# EAGLE design Line Follower (EAGLE 8.6.0)

## Sheet 1 of 4: Logic
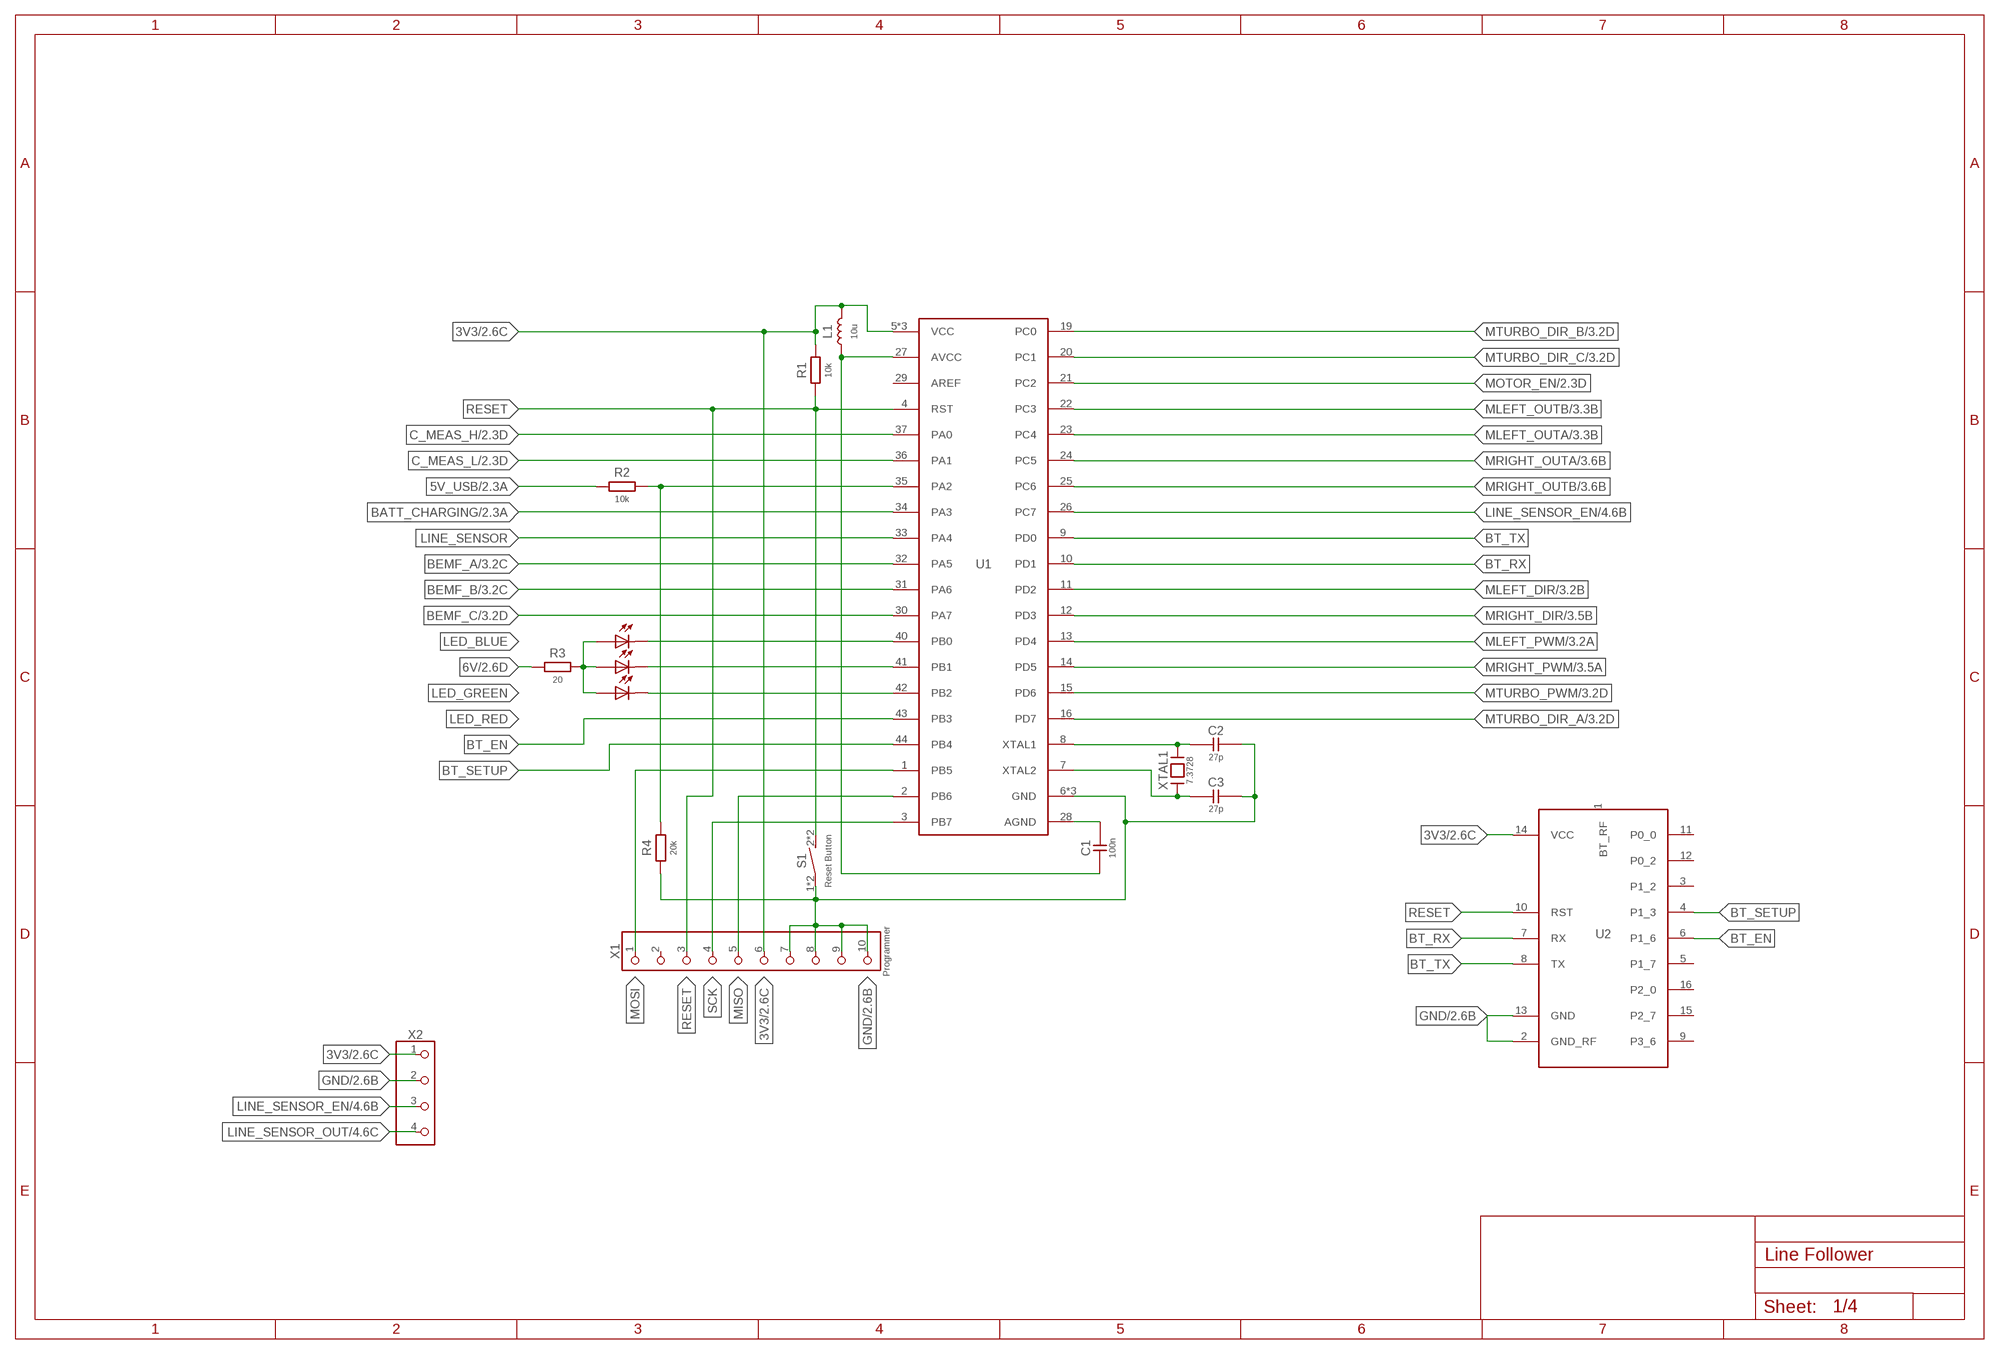
[diagram p0: schematic, sheet 1]

### Parts
C1  100n  CAPACITORSMD_1206  [SMD_1206]
C2  27p  CAPACITORSMD_1206  [SMD_1206]
C3  27p  CAPACITORSMD_1206  [SMD_1206]
D1  RGB_LEDOSTCXBSEC1E  [OSTCXBSEC1E]
L1  10u  INDUCTORSMD_1206  [SMD_1206]
R1  10k  RESISTORSMD_1206  [SMD_1206]
R2  10k  RESISTORSMD_1206  [SMD_1206]
R3  20  RESISTORSMD_1206  [SMD_1206]
R4  20k  RESISTORSMD_1206  [SMD_1206]
S1  Reset Button  SCHURTER_BUTTON  [SCHURTER_BUTTON]
U1  ATMEGA1284TQFP  [TQFP-44]
U2  RN4871  [RN4871]
X1  Programmer  CONNECTOR_10PINMALE_1WAY_2X5  [MALE_1WAY_2X5]
X2  CONNECTOR_4PINMALE_PIN_1X4  [MALE_PIN_1X4]
XTAL1  7.3728  OSCILLATORSMD_11MM  [SMD_OSCILLATOR]

### Nets
3V3: L1.2 R1.2 U1.5(VCC) U1.17(VCC) U1.38(VCC) U2.14(VCC) X1.6 X2.1 ; also sheet 2,3,4
5V_USB: R2.1 ; also sheet 2
6V: R3.2 ; also sheet 2,3
AVCC: C1.1 L1.1 U1.27(AVCC)
BATT_CHARGING: U1.34(PA3) ; also sheet 2
BEMF_A: U1.32(PA5) ; also sheet 3
BEMF_B: U1.31(PA6) ; also sheet 3
BEMF_C: U1.30(PA7) ; also sheet 3
BT_EN: U1.43(PB3) U2.6(P1_6)
BT_RX: U1.10(PD1) U2.7(RX)
BT_SETUP: U1.44(PB4) U2.4(P1_3)
BT_TX: U1.9(PD0) U2.8(TX)
C_MEAS_H: U1.37(PA0) ; also sheet 2
C_MEAS_L: U1.36(PA1) ; also sheet 2
GND [GND]: C2.1 C3.1 R4.1 S1.1(P) S1.3(P) U1.6(GND) U1.18(GND) U1.39(GND) U2.2(GND_RF) U2.13(GND) X1.7 X1.8 X1.9 X1.10 X2.2 ; also sheet 2,3,4
LED_BLUE: D1.3(BLUE:K) U1.40(PB0)
LED_GREEN: D1.1(GREEN:K) U1.41(PB1)
LED_RED: D1.2(RED:K) U1.42(PB2)
LINE_SENSOR: U1.33(PA4)
LINE_SENSOR_EN: U1.26(PC7) X2.3 ; also sheet 4
LINE_SENSOR_OUT: X2.4 ; also sheet 4
MISO: U1.2(PB6) X1.5
MLEFT_DIR: U1.11(PD2) ; also sheet 3
MLEFT_OUTA: U1.23(PC4) ; also sheet 3
MLEFT_OUTB: U1.22(PC3) ; also sheet 3
MLEFT_PWM: U1.13(PD4) ; also sheet 3
MOSI: U1.1(PB5) X1.1
MOTOR_EN: U1.21(PC2) ; also sheet 2,3
MRIGHT_DIR: U1.12(PD3) ; also sheet 3
MRIGHT_OUTA: U1.24(PC5) ; also sheet 3
MRIGHT_OUTB: U1.25(PC6) ; also sheet 3
MRIGHT_PWM: U1.14(PD5) ; also sheet 3
MTURBO_DIR_A: U1.16(PD7) ; also sheet 3
MTURBO_DIR_B: U1.19(PC0) ; also sheet 3
MTURBO_DIR_C: U1.20(PC1) ; also sheet 3
MTURBO_PWM: U1.15(PD6) ; also sheet 3
N$1: C3.2 U1.7(XTAL2) XTAL1.1
N$2: C2.2 U1.8(XTAL1) XTAL1.2
N$24: C1.2 U1.28(AGND)
N$37: D1.4(BLUE:A) D1.5(RED:A) D1.6(GREEN:A) D1.PAD(RED:A) R3.1
RESET [Signal]: R1.1 S1.2(S) S1.4(S) U1.4(RST) U2.10(RST) X1.3
SCK: U1.3(PB7) X1.4
USB_CONNECTED: R2.2 R4.2 U1.35(PA2)
Unconnected: U1.29(AREF) U2.1(BT_RF) U2.3(P1_2) U2.5(P1_7) U2.9(P3_6) U2.11(P0_0) U2.12(P0_2) U2.15(P2_7) U2.16(P2_0) X1.2

## Sheet 2 of 4: Power supply
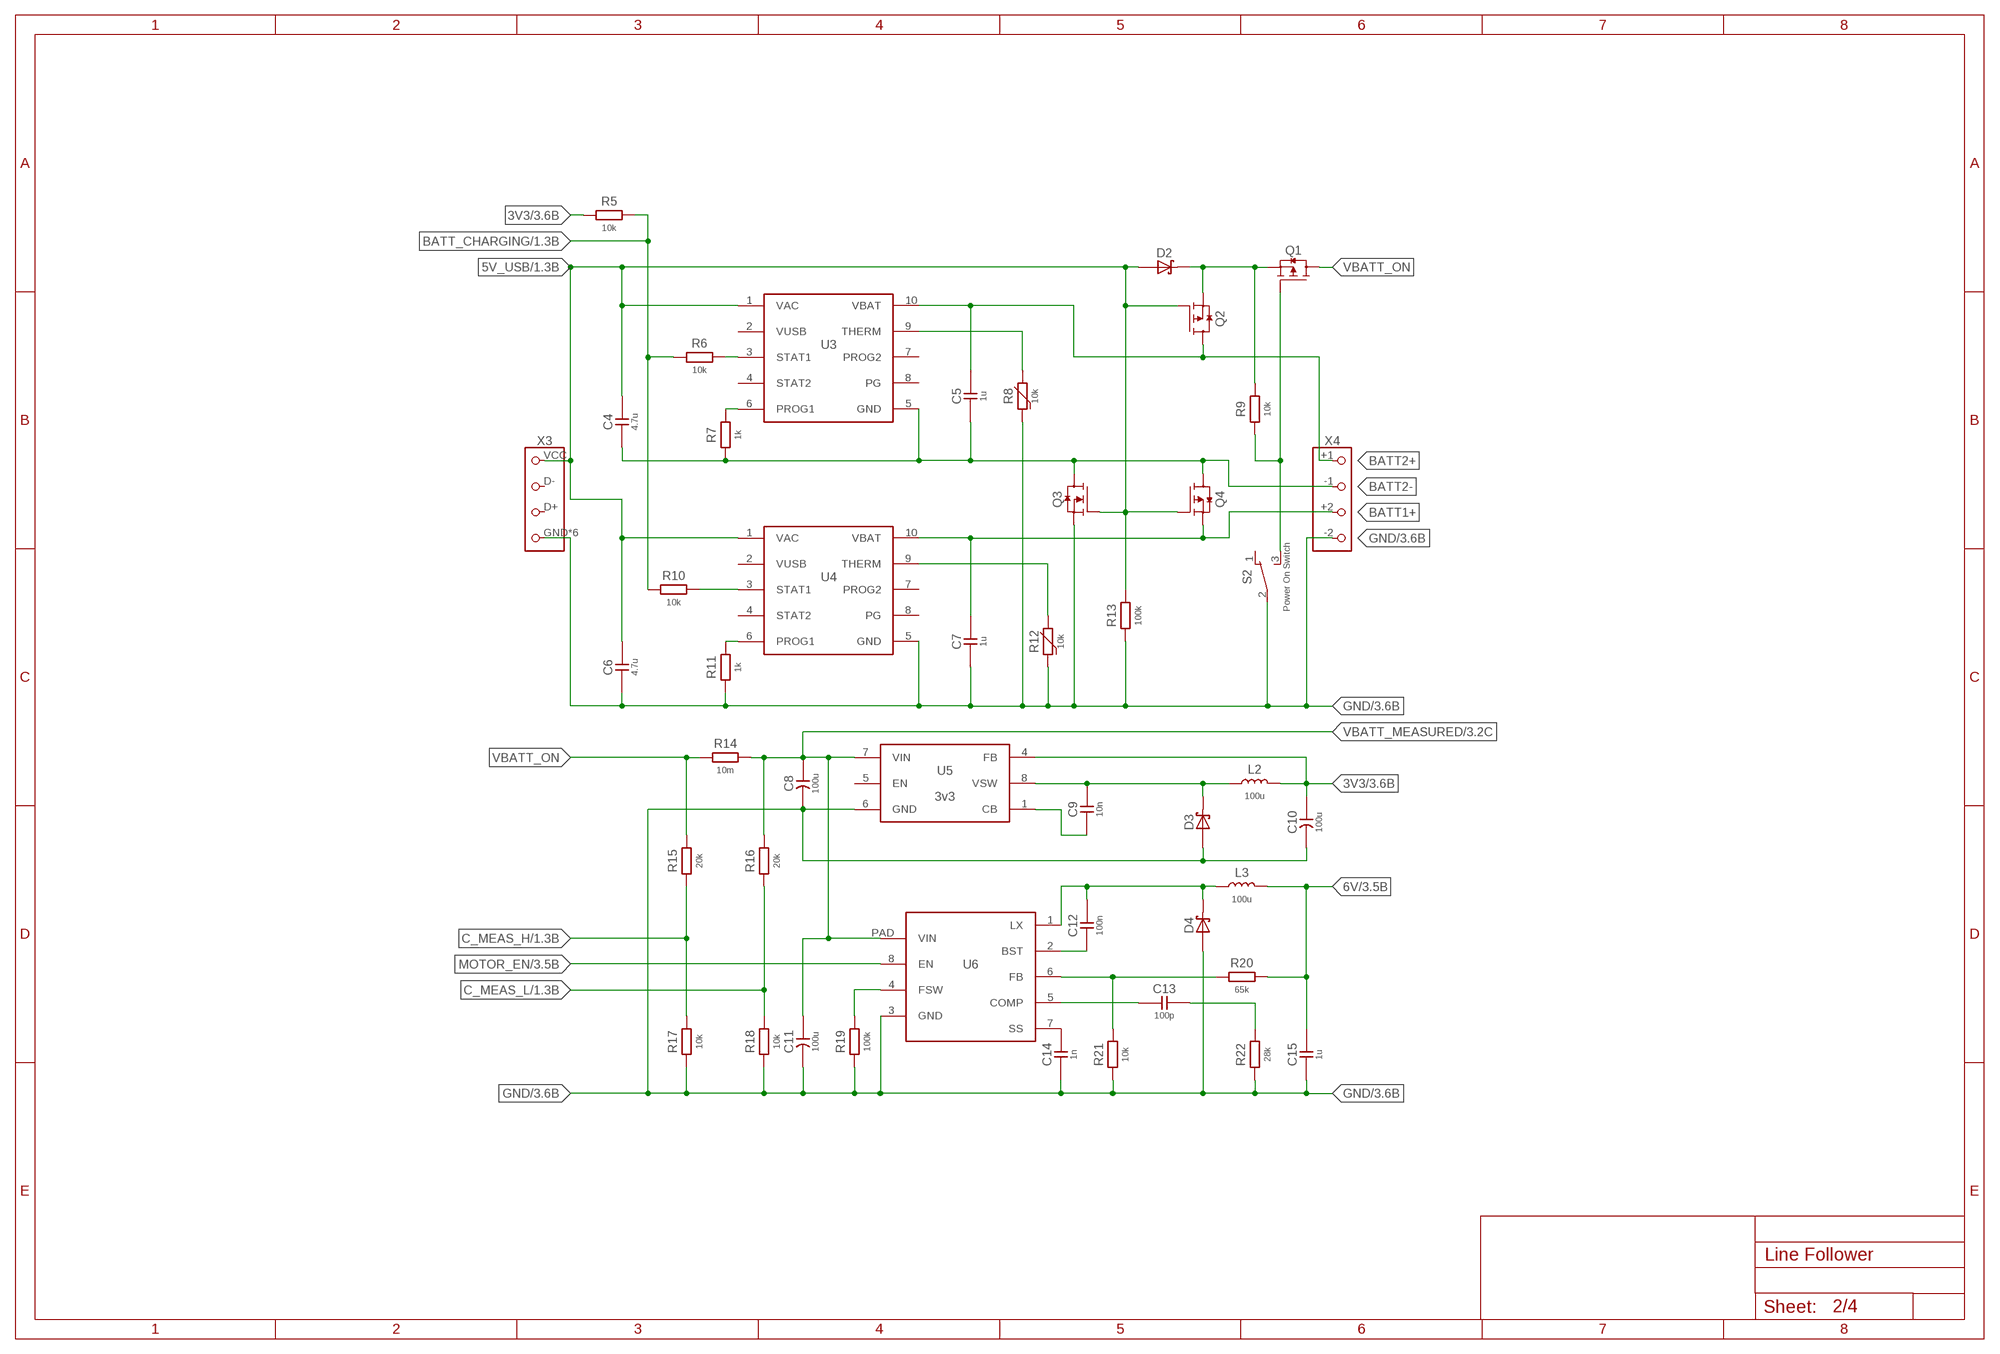
[diagram p1: schematic, sheet 2]

### Parts
C4  4.7u  CAPACITORSMD_1206  [SMD_1206]
C5  1u  CAPACITORSMD_1206  [SMD_1206]
C6  4.7u  CAPACITORSMD_1206  [SMD_1206]
C7  1u  CAPACITORSMD_1206  [SMD_1206]
C8  100u  ELECTROLYTIC_CAPACITORSMD_1210  [SMD_1210]
C9  10n  CAPACITORSMD_1206  [SMD_1206]
C10  100u  ELECTROLYTIC_CAPACITORSMD_1210  [SMD_1210]
C11  100u  ELECTROLYTIC_CAPACITORSMD_1210  [SMD_1210]
C12  100n  CAPACITORSMD_1206  [SMD_1206]
C13  100p  CAPACITORSMD_1206  [SMD_1206]
C14  1n  CAPACITORSMD_1206  [SMD_1206]
C15  1u  CAPACITORSMD_1206  [SMD_1206]
D2  BAS3010BSOD232  [SOD323]
D3  BAS3010BSOD232  [SOD323]
D4  BAS3010BSOD232  [SOD323]
L2  100u  INDUCTORSMD_1206  [SMD_1206]
L3  100u  INDUCTORSMD_1206  [SMD_1206]
Q1  AOD417  [TO-252]
Q2  AOD417  [TO-252]
Q3  AOD480  [TO-252]
Q4  AOD417  [TO-252]
R5  10k  RESISTORSMD_1206  [SMD_1206]
R6  10k  RESISTORSMD_1206  [SMD_1206]
R7  1k  RESISTORSMD_1206  [SMD_1206]
R8  10k  NTC_THERMISTOR  [SMD_0805]
R9  10k  RESISTORSMD_1206  [SMD_1206]
R10  10k  RESISTORSMD_1206  [SMD_1206]
R11  1k  RESISTORSMD_1206  [SMD_1206]
R12  10k  NTC_THERMISTOR  [SMD_0805]
R13  100k  RESISTORSMD_1206  [SMD_1206]
R14  10m  RESISTORSMD_1206  [SMD_1206]
R15  20k  RESISTORSMD_1206  [SMD_1206]
R16  20k  RESISTORSMD_1206  [SMD_1206]
R17  10k  RESISTORSMD_1206  [SMD_1206]
R18  10k  RESISTORSMD_1206  [SMD_1206]
R19  100k  RESISTORSMD_1206  [SMD_1206]
R20  65k  RESISTORSMD_1206  [SMD_1206]
R21  10k  RESISTORSMD_1206  [SMD_1206]
R22  28k  RESISTORSMD_1206  [SMD_1206]
S2  Power On Switch  NINIGI_5MS1  [NINIGI_5MS1]
U3  MCP73837MSOP_10  [MSOP_10]
U4  MCP73837MSOP_10  [MSOP_10]
U5  3v3  LM2674  [SO8]
U6  AOZ1284  [SO8_EP]
X3  USB_CONNECTORMICRO_USB  [MICRO_USB_FEMALE]
X4  CONNECTOR_4PINBATTERY_18650X2  [BATTERY_186501X2]

### Nets
3V3: C10.1(+) L2.2 R5.1 U5.4(FB) ; also sheet 1,3,4
5V_USB: C4.2 C6.2 D2.1(A) Q2.1(G) Q3.1(G) Q4.1(G) R13.2 U3.1(VAC) U4.1(VAC) X3.VCC ; also sheet 1
6V: C15.2 L3.2 R20.2 ; also sheet 1,3
BATT1+ [High Current]: C7.2 Q4.2(S) U4.10(VBAT) X4.+2
BATT2+ [High Current]: C5.2 Q2.3(D) U3.10(VBAT) X4.+1
BATT2- [High Current]: C4.1 C5.1 Q3.3(D) Q4.3(D) R7.1 U3.5(GND) X4.-1
BATT_CHARGING: R5.2 R6.1 R10.1 ; also sheet 1
BATTERY1_CHARGING1: R10.2 U4.3(STAT1)
BATTERY2_CHARGING1: R6.2 U3.3(STAT1)
C_MEAS_H: R15.1 R17.2 ; also sheet 1
C_MEAS_L: R16.1 R18.2 ; also sheet 1
GND [GND]: C6.1 C7.1 C8.2(-) C10.2(-) C11.2(-) C14.1 C15.1 D3.1(A) D4.1(A) Q3.2(S) R8.1 R11.1 R12.1 R13.1 R17.1 R18.1 R19.1 R21.1 R22.1 S2.2(MIDDLE) U4.5(GND) U5.6(GND) U6.3(GND) X3.GND X3.NC X3.NC@2 X3.NC@3 X3.NC@4 X3.NC@5 X4.-2 ; also sheet 1,3,4
MOTOR_EN: U6.8(EN) ; also sheet 1,3
N$3: C9.1 U5.1(CB)
N$41: R19.2 U6.4(FSW)
N$42: C14.2 U6.7(SS)
N$43: C13.1 U6.5(COMP)
N$44: C13.2 R22.2
N$45: C12.1 U6.2(BST)
N$46: C12.2 D4.2(K) L3.1 U6.1(LX)
N$48: R20.1 R21.2 U6.6(FB)
THERM2 [Signal]: R12.2 U4.9(THERM)
THERM3 [Signal]: R8.2 U3.9(THERM)
V_LIMIT2 [Signal]: R11.2 U4.6(PROG1)
V_LIMIT3 [Signal]: R7.2 U3.6(PROG1)
VBATT1: D2.2(K) Q1.2(S) Q2.2(S) R9.2
VBATT_MEASURED [High Current]: C8.1(+) C11.1(+) R14.2 R16.2 U5.7(VIN) U6.PAD(VIN) ; also sheet 3
VBATT_ON [High Current]: Q1.3(D) R14.1 R15.2
VG1: Q1.1(G) R9.1 S2.3(SIDE2)
VSW: C9.2 D3.2(K) L2.1 U5.8(VSW)
Unconnected: S2.1(SIDE1) U3.4(STAT2) U3.7(PROG2) U3.8(PG) U4.4(STAT2) U4.7(PROG2) U4.8(PG) U5.5(EN) X3.D+ X3.D-

## Sheet 3 of 4: Motors
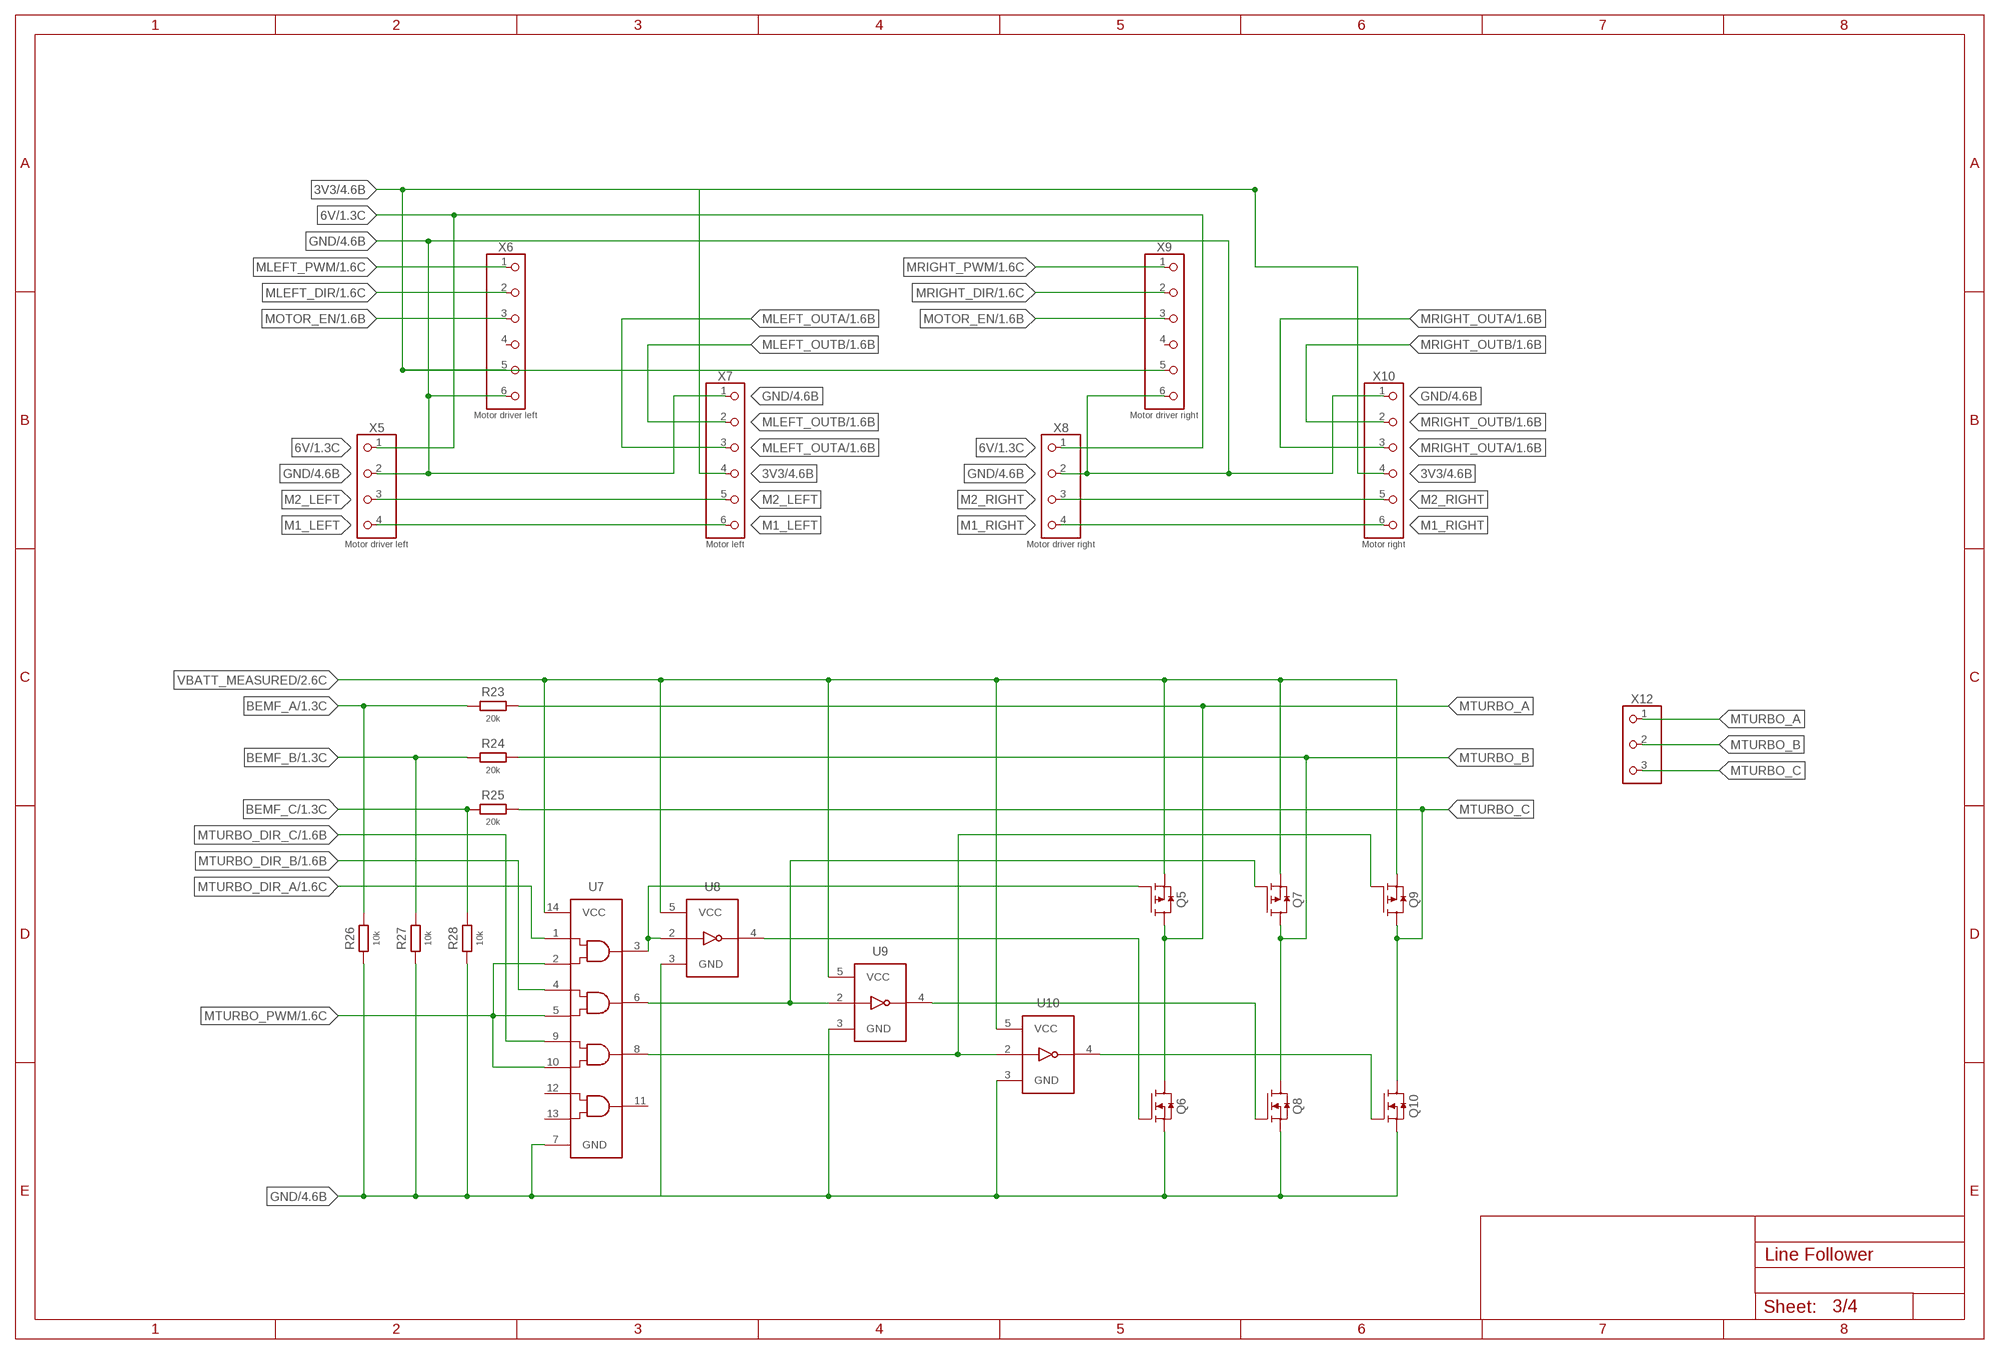
[diagram p2: schematic, sheet 3]

### Parts
Q5  AOD417  [TO-252]
Q6  AOD480  [TO-252]
Q7  AOD417  [TO-252]
Q8  AOD480  [TO-252]
Q9  AOD417  [TO-252]
Q10  AOD480  [TO-252]
R23  20k  RESISTORSMD_1206  [SMD_1206]
R24  20k  RESISTORSMD_1206  [SMD_1206]
R25  20k  RESISTORSMD_1206  [SMD_1206]
R26  10k  RESISTORSMD_1206  [SMD_1206]
R27  10k  RESISTORSMD_1206  [SMD_1206]
R28  10k  RESISTORSMD_1206  [SMD_1206]
U7  74AHC08D  [SO14]
U8  74LVC1G14SOT25  [SOT25]
U9  74LVC1G14SOT25  [SOT25]
U10  74LVC1G14SOT25  [SOT25]
X5  Motor driver left  CONNECTOR_4PINMALE_PIN_1X4  [MALE_PIN_1X4]
X6  Motor driver left  CONNECTOR_6PINMALE_PIN_1X6  [MALE_PIN_1X6]
X7  Motor left  CONNECTOR_6PINMALE_PIN_2X3  [MALE_PIN_2X3]
X8  Motor driver right  CONNECTOR_4PINMALE_PIN_1X4  [MALE_PIN_1X4]
X9  Motor driver right  CONNECTOR_6PINMALE_PIN_1X6  [MALE_PIN_1X6]
X10  Motor right  CONNECTOR_6PINMALE_PIN_2X3  [MALE_PIN_2X3]
X12  CONNECTOR_3PIN  [SCREW_1X3]

### Nets
3V3: X6.5 X7.4 X9.5 X10.4 ; also sheet 1,2,4
6V: X5.1 X8.1 ; also sheet 1,2
BEMF_A: R23.1 R26.2 ; also sheet 1
BEMF_B: R24.1 R27.2 ; also sheet 1
BEMF_C: R25.1 R28.2 ; also sheet 1
GND [GND]: Q6.2(S) Q8.2(S) Q10.2(S) R26.1 R27.1 R28.1 U7.7(GND) U8.3(GND) U9.3(GND) U10.3(GND) X5.2 X6.6 X7.1 X8.2 X9.6 X10.1 ; also sheet 1,2,4
M1_LEFT: X5.4 X7.6
M1_RIGHT: X8.4 X10.6
M2_LEFT: X5.3 X7.5
M2_RIGHT: X8.3 X10.5
MLEFT_DIR: X6.2 ; also sheet 1
MLEFT_OUTA: X7.3 ; also sheet 1
MLEFT_OUTB: X7.2 ; also sheet 1
MLEFT_PWM: X6.1 ; also sheet 1
MOTOR_EN: X6.3 X9.3 ; also sheet 1,2
MRIGHT_DIR: X9.2 ; also sheet 1
MRIGHT_OUTA: X10.3 ; also sheet 1
MRIGHT_OUTB: X10.2 ; also sheet 1
MRIGHT_PWM: X9.1 ; also sheet 1
MTURBO_A [High Current]: Q5.3(D) Q6.3(D) R23.2 X12.1
MTURBO_B [High Current]: Q7.3(D) Q8.3(D) R24.2 X12.2
MTURBO_C [High Current]: Q9.3(D) Q10.3(D) R25.2 X12.3
MTURBO_DIR_A: U7.1(A1) ; also sheet 1
MTURBO_DIR_B: U7.4(A2) ; also sheet 1
MTURBO_DIR_C: U7.9(A3) ; also sheet 1
MTURBO_PWM: U7.2(B1) U7.5(B2) U7.10(B3) ; also sheet 1
N$5: Q5.1(G) U7.3(Y1) U8.2(A)
N$6: Q6.1(G) U8.4(Y)
N$19: Q7.1(G) U7.6(Y2) U9.2(A)
N$38: Q8.1(G) U9.4(Y)
N$39: Q10.1(G) U10.4(Y)
N$40: Q9.1(G) U7.8(Y3) U10.2(A)
VBATT_MEASURED [High Current]: Q5.2(S) Q7.2(S) Q9.2(S) U7.14(VCC) U8.5(VCC) U9.5(VCC) U10.5(VCC) ; also sheet 2
Unconnected: U7.11(Y4) U7.12(A4) U7.13(B4) X6.4 X9.4

## Sheet 4 of 4: Sensors
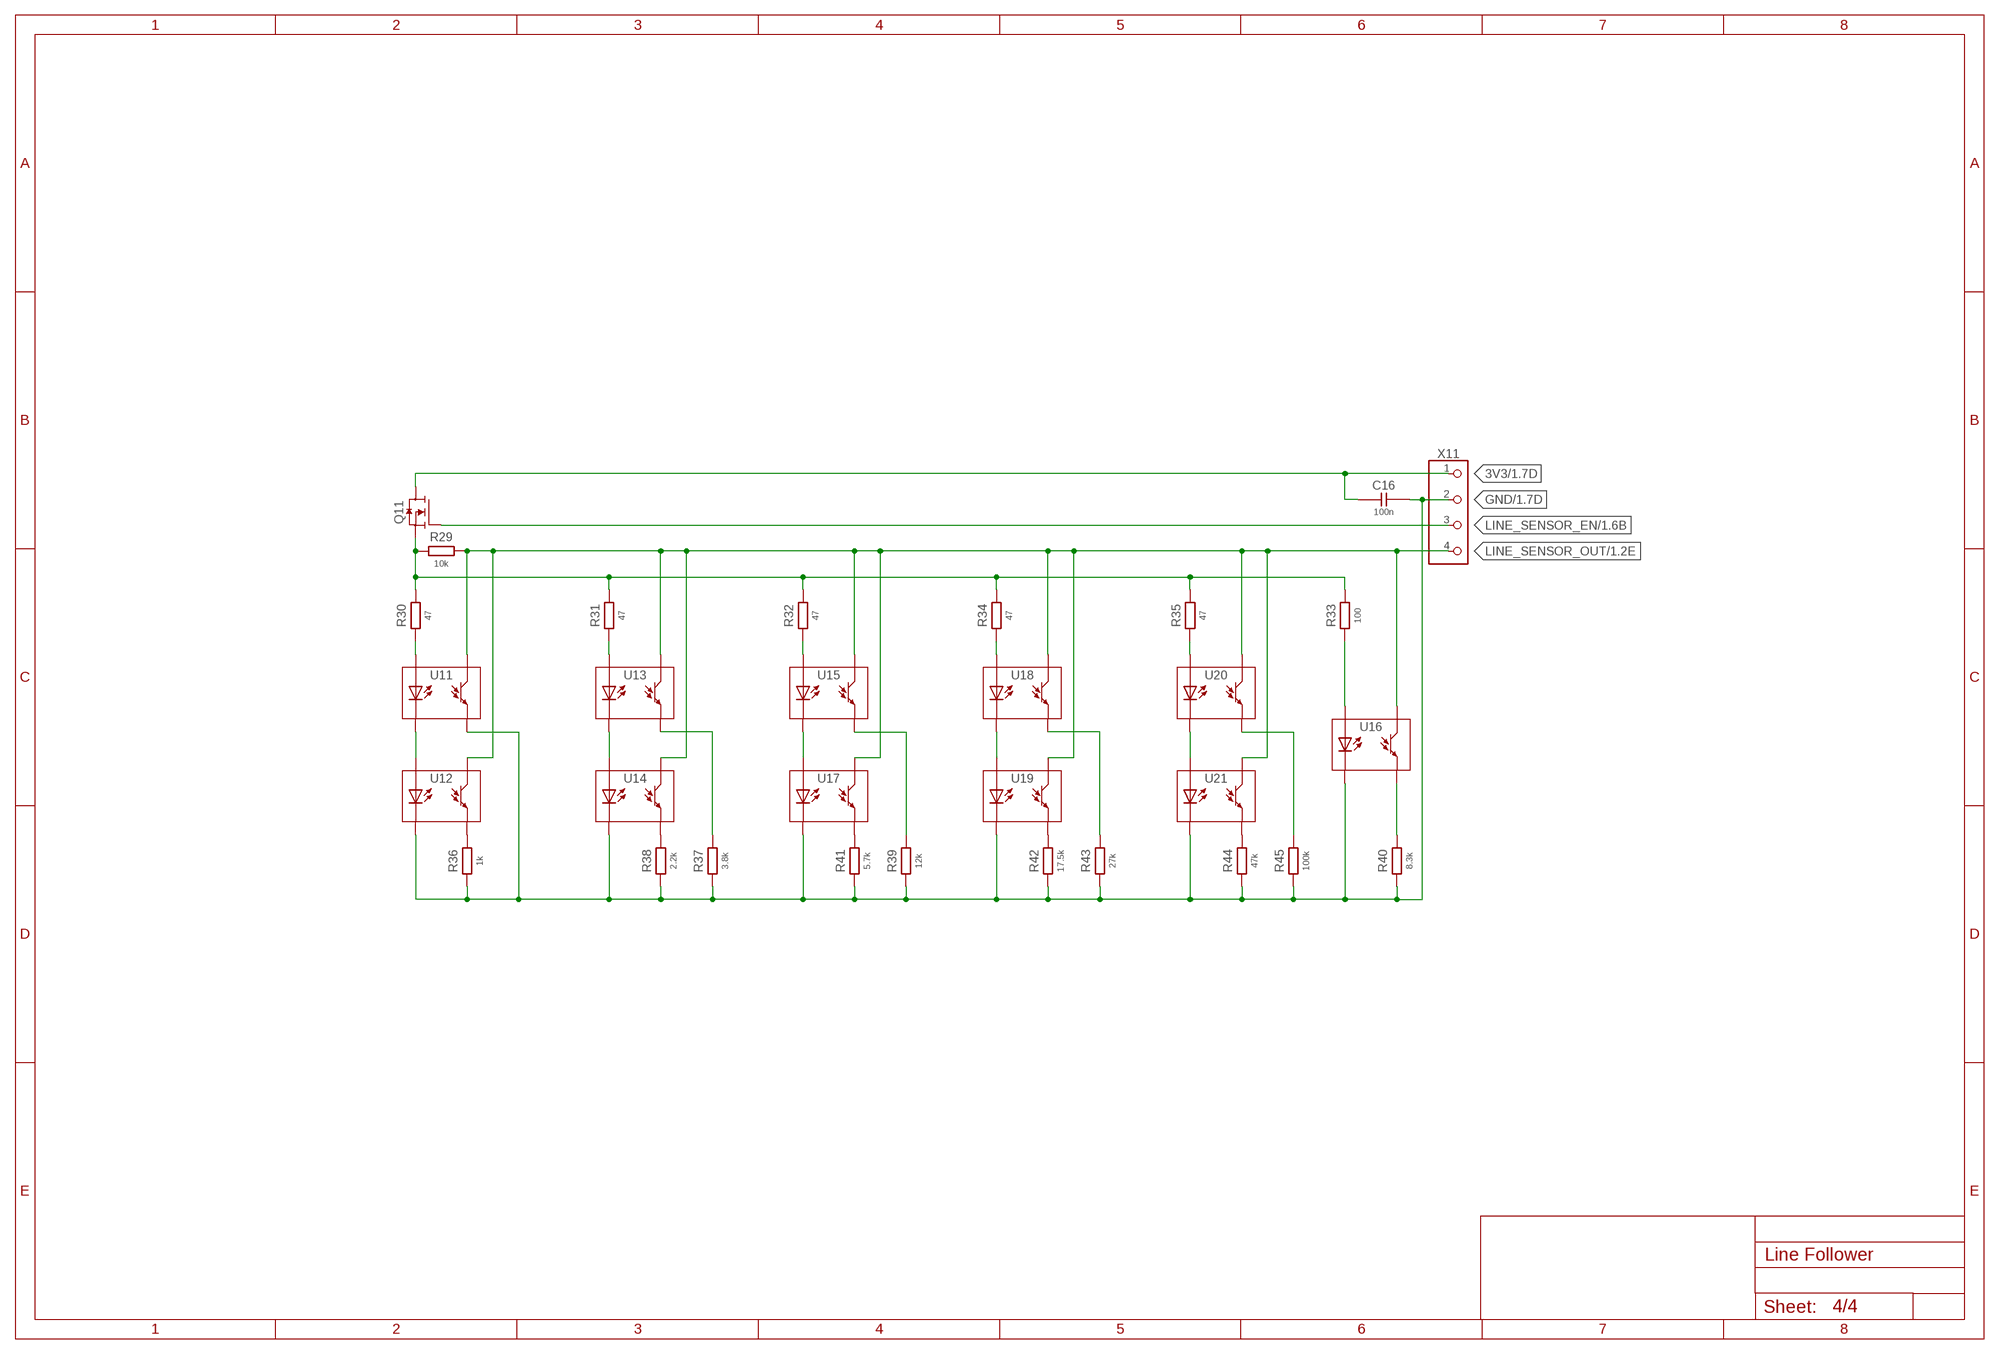
[diagram p3: schematic, sheet 4]

### Parts
C16  100n  CAPACITORSMD_1206  [SMD_1206]
Q11  AO3414SOT23  [SOT23]
R29  10k  RESISTORSMD_1206  [SMD_1206]
R30  47  RESISTORSMD_1206  [SMD_1206]
R31  47  RESISTORSMD_1206  [SMD_1206]
R32  47  RESISTORSMD_1206  [SMD_1206]
R33  100  RESISTORSMD_1206  [SMD_1206]
R34  47  RESISTORSMD_1206  [SMD_1206]
R35  47  RESISTORSMD_1206  [SMD_1206]
R36  1k  RESISTORSMD_1206  [SMD_1206]
R37  3.8k  RESISTORSMD_1206  [SMD_1206]
R38  2.2k  RESISTORSMD_1206  [SMD_1206]
R39  12k  RESISTORSMD_1206  [SMD_1206]
R40  8.3k  RESISTORSMD_1206  [SMD_1206]
R41  5.7k  RESISTORSMD_1206  [SMD_1206]
R42  17.5k  RESISTORSMD_1206  [SMD_1206]
R43  27k  RESISTORSMD_1206  [SMD_1206]
R44  47k  RESISTORSMD_1206  [SMD_1206]
R45  100k  RESISTORSMD_1206  [SMD_1206]
U11  EE-SY171  [EE-SY171]
U12  EE-SY171  [EE-SY171]
U13  EE-SY171  [EE-SY171]
U14  EE-SY171  [EE-SY171]
U15  EE-SY171  [EE-SY171]
U16  EE-SY171  [EE-SY171]
U17  EE-SY171  [EE-SY171]
U18  EE-SY171  [EE-SY171]
U19  EE-SY171  [EE-SY171]
U20  EE-SY171  [EE-SY171]
U21  EE-SY171  [EE-SY171]
X11  CONNECTOR_4PINMALE_PIN_1X4  [MALE_PIN_1X4]

### Nets
3V3: C16.1 Q11.3(D) X11.1 ; also sheet 1,2,3
3V3_SENSOR_LEDS: Q11.2(S) R29.1 R30.2 R31.2 R32.2 R33.2 R34.2 R35.2
GND [GND]: C16.2 R36.1 R37.1 R38.1 R39.1 R40.1 R41.1 R42.1 R43.1 R44.1 R45.1 U11.E U12.K U14.K U16.K U17.K U19.K U21.K X11.2 ; also sheet 1,2,3
LINE_SENSOR_EN: Q11.1(G) X11.3 ; also sheet 1
LINE_SENSOR_OUT: R29.2 U11.C U12.C U13.C U14.C U15.C U16.C U17.C U18.C U19.C U20.C U21.C X11.4 ; also sheet 1
N$4: R36.2 U12.E
N$7: R37.2 U13.E
N$8: R30.1 U11.A
N$9: U11.K U12.A
N$10: R32.1 U15.A
N$11: R31.1 U13.A
N$12: U13.K U14.A
N$13: U15.K U17.A
N$14: R34.1 U18.A
N$15: U18.K U19.A
N$16: R35.1 U20.A
N$17: U20.K U21.A
N$18: R33.1 U16.A
N$21: R38.2 U14.E
N$23: R41.2 U17.E
N$25: R39.2 U15.E
N$26: R43.2 U18.E
N$27: R42.2 U19.E
N$28: R45.2 U20.E
N$29: R44.2 U21.E
N$30: R40.2 U16.E

## Power pins joined to a net without a drawn wire
VUSB: U3.2(VUSB) U4.2(VUSB)

## Library data of the parts
C1-C7 C9 C12-C16 = Passives:CAPACITOR: Capacitor
C8 C10 C11 = Passives:ELECTROLYTIC_CAPACITOR: Polarized Capacitor
D1 = Diodes:RGB_LED: RGB Light Emitting Diode Component Datasheet Size Max Current Red Green Blue Forward Voltage Light Intensity Forward Voltage Light Intensity Forward Voltage Light Intensity OSTCXBSEC1E link <https://drive.google.com/open?id=0Bx3EyoegSWevejRzQ2RTeXJZWlE> 5 x 5 mm 0.2 A 3 V 20 cd 4 V 30 cd 4 V 10 cd
D2-D4 = Diodes:BAS3010B: 1A Schottky Diode Datasheet <https://drive.google.com/open?id=1SUklUejxSsK_loDkWrmXe8l06rycU1cd>
L1-L3 = Passives:INDUCTOR: Inductor
Q1 Q2 Q4 Q5 Q7 Q9 = Transistors:AOD417: P-Channel Power MOSFET Datasheet <https://drive.google.com/open?id=1Aunkt1MHwGkiisX0zOAecL08vsd4hyX1>
Q3 Q6 Q8 Q10 = Transistors:AOD480: N-Channel Power MOSFET Datasheet <https://drive.google.com/open?id=1A--VhvA1nJOWM3Svf2NN694U875h77Qz>
Q11 = Transistors:AO3414: N-Channel MOSFET Datasheet <https://drive.google.com/open?id=1qTh0uGaWsRbTcbcgMJPDG488iiwtG9qB>
R1-R7 R9-R11 R13-R45 = Passives:RESISTOR: Resistor
R8 R12 = Sensors:NTC_THERMISTOR: NTC thermistor Datasheet <https://drive.google.com/open?id=1b__oivFvJCLTu-I3nkRL9Yym-Pu1nq4O>
S1 = Switches:SCHURTER_BUTTON: Schurter 4 pin push button Datasheet <https://drive.google.com/open?id=0Bx3EyoegSWevNWNmZm9YRVBlUGM>
S2 = Switches:NINIGI_5MS1: Ninigi Sliding ON-ON Switch Datasheet <https://drive.google.com/open?id=0Bx3EyoegSWevV2ZieUhfOUJ4c3M>
U1 = Microcontrollers:ATMEGA1284: ATmega1284 microcontroller Datasheet <https://drive.google.com/open?id=0Bx3EyoegSWevTDFya0JFOFlISGs> Component Supply Voltage Flash RAM EEPROM GPIO SPI I²C USART ADC Analog Comparator Timer PWM channels ATmega164A 1.8 - 5.5 V 16 KB 1 KB 512 B 32 1 1 2 8 Yes 2x 8bit 1x16bit 6 ATmega1284 1.8 - 5.5 V 128 KB 16 KB 4 KB 32 1 1 2 8 Yes 2x 8bit 2x16bit 8
U2 = Connectivity:RN4871: Bluetooth Low Energy Module Datasheet <https://drive.google.com/open?id=1NkqynHbIP-o5lnyX2JICYtW1r08LJTsi>
U3 U4 = Power Supplies:MCP73837: Battery Charger IC Datasheet <https://drive.google.com/open?id=1-k8jIzv3KBvhRDoBXnw6zvFG6jC2mRKT>
U5 = Power Supplies:LM2674: 0.5A Buck Voltage Regulator Datasheet <https://drive.google.com/open?id=1WJqYYVweJX4pnpGntj-szZUzQ_4m9e_Y>
U6 = Power Supplies:AOZ1284: 4A Switching Voltage Regulator Datasheet <https://drive.google.com/open?id=1SnWALYsNMSSKAO4NdofQXGKhfeYloVpu>
U7 = Logic Gates:74AHC08D: 4x AND Gate Datasheet <https://drive.google.com/open?id=1PSXJBb9GabwWpHZvc_EieywMAM0f-NCc>
U8-U10 = Logic Gates:74LVC1G14: NOT Gate Datasheet <https://drive.google.com/open?id=1jwQqcpQM22X5ci8ic_J9g7CQ6ZkM5pUF>
U11-U21 = Sensors:EE-SY171: EE-SY171 Photosensor Datasheet <https://drive.google.com/file/d/0Bx3EyoegSWevTVJucUhmTTlDck0>
X1 = Connectors:CONNECTOR_10PIN: 10 Pin Connector
X2 X4 X5 X8 X11 = Connectors:CONNECTOR_4PIN: 4 Pin Connector
X3 = Connectors:USB_CONNECTOR: USB Connector
X6 X7 X9 X10 = Connectors:CONNECTOR_6PIN: 6 Pin Connector
X12 = Connectors:CONNECTOR_3PIN: 3 Pin Connector
XTAL1 = Passives:OSCILLATOR: Crystal oscillator

## Net classes
0 VCC: width 1 mm, drill 0.4 mm, clearance 0.2 mm
1 GND: width 1 mm, drill 0.4 mm, clearance 0.2 mm
2 Signal: width 0.3 mm, drill 0.4 mm, clearance 0.2 mm
3 High Current: width 2 mm, drill 0.4 mm, clearance 0.2 mm

## Board
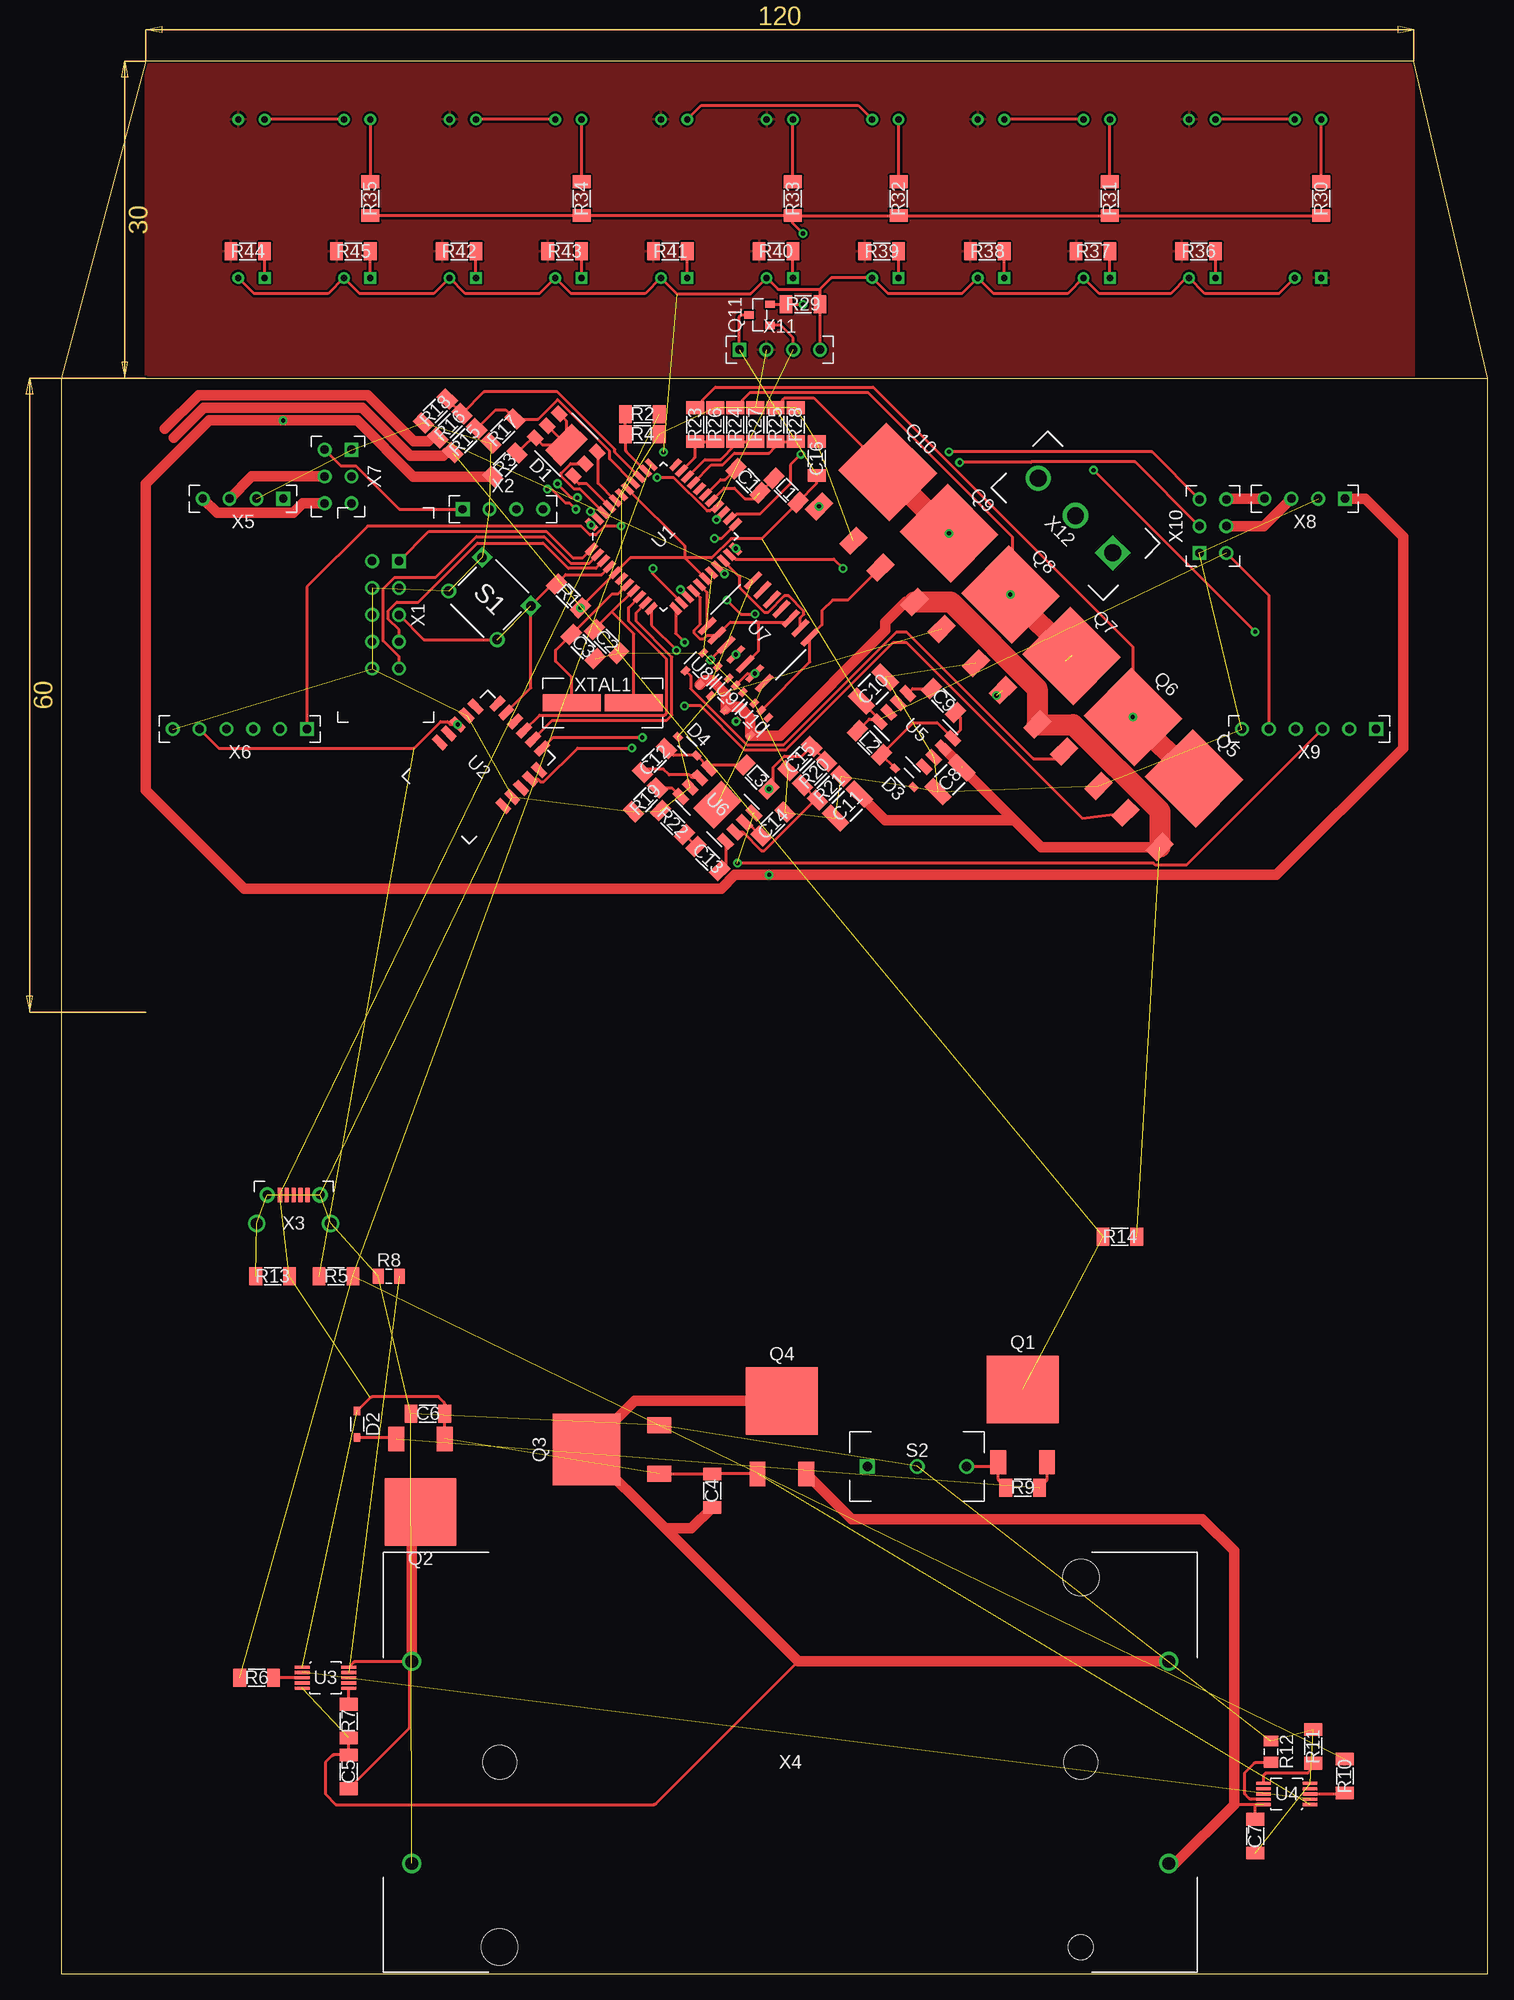
[diagram p4: board, top side]
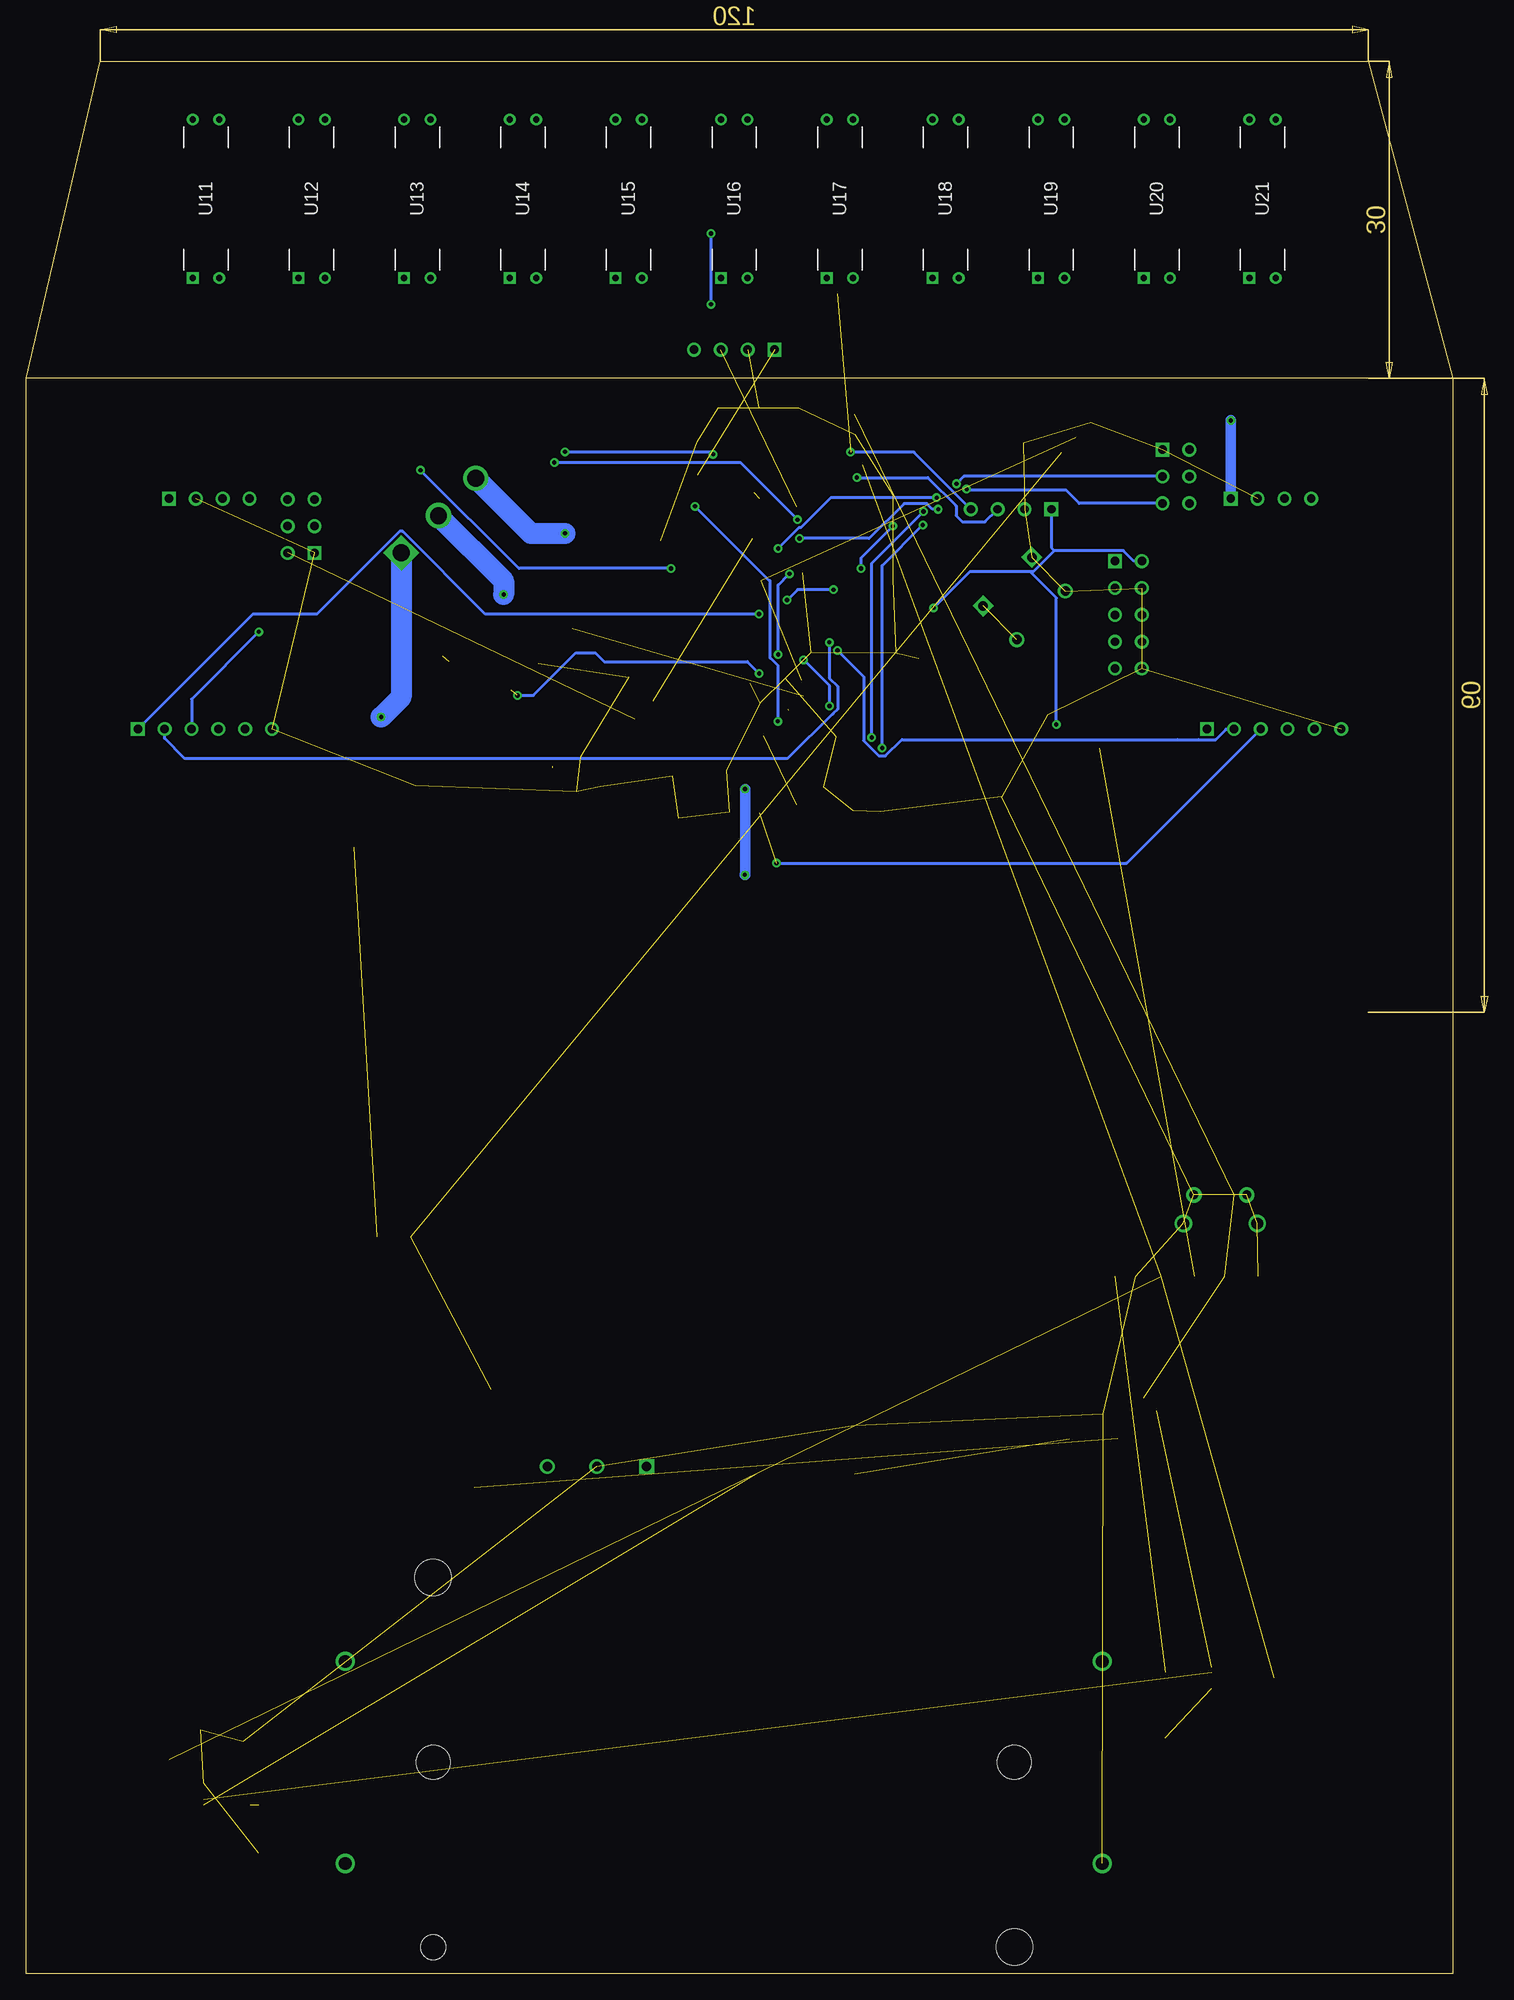
[diagram p5: board, bottom side, seen from below]

Size 135 x 181 mm. Coordinates in mm from the lower left corner, seen from the top.
Outline: 135,151 135,0 0,0 0,151
Outline: 0,151 8,181 128,181 135,151
Outline: 0,151 135,151
Copper layers (1*16): Top 0.035mm / dielectric 1.5mm / Bottom 0.035mm
Design rules "Design Rules": minimum track width 0.2mm, minimum drill 0.4mm, track to track 0.2mm, track to pad 0.2mm, pad to pad 0.2mm, via to via 0.2mm, smd to smd 0.2mm, copper to edge 0.2mm, drill to drill 0.5mm, minimum pad ring 10mil, minimum via ring 8mil, stop-mask expansion 4mil, vias tented up to drill 0mil, thermal gap 10mil

### Footprints (pad centres in the part's own frame; a part is rotated, then mirrored left to right if it is on the bottom)
SMD_1206 = smd 1.2 x 1.7: 1 -1.6,0; 2 1.6,0
SMD_1210 = smd 1.2 x 2.5: 1 -1.6,0; 2 1.6,0
OSTCXBSEC1E = smd 1.3 x 1: 1 -2.55,1.6; 2 -2.55,0; 3 -2.55,-1.6; 4 2.55,-1.6; 5 2.55,0; 6 2.55,1.6 | smd 2.1 x 3.6: PAD 0,0
SOD323 = smd 0.8 x 0.6: 1 -1.25,0; 2 1.25,0
TO-252 = smd 1.5 x 2.3: 1 -2.3,-4.6; 2 2.3,-4.6 | smd 6.8 x 6.4: 3 0,2.3
SOT23 = smd 0.7 x 0.9: 1 -1,-1; 2 1,-1; 3 0,1
SMD_0805 = smd 1 x 1.4: 1 -1,0; 2 1,0
SCHURTER_BUTTON = drill 0.9 square: 1 -3.25,2.25; 2 3.25,2.25 | drill 0.9: 3 -3.25,-2.25; 4 3.25,-2.25
NINIGI_5MS1 = drill 0.9 square: 1 -4.7,0 | drill 0.9: 2 0,0; 3 4.7,0
TQFP-44 = smd 1.27 x 0.508: 1 -5.627,4; 2 -5.627,3.2; 3 -5.627,2.4; 4 -5.627,1.6; 5 -5.627,0.8; 6 -5.627,0; 7 -5.627,-0.8; 8 -5.627,-1.6; 9 -5.627,-2.4; 10 -5.627,-3.2; 11 -5.627,-4; 23 5.627,-4; 24 5.627,-3.2; 25 5.627,-2.4; 26 5.627,-1.6; 27 5.627,-0.8; 28 5.627,0; 29 5.627,0.8; 30 5.627,1.6; 31 5.627,2.4; 32 5.627,3.2; 33 5.627,4 | smd 0.508 x 1.27: 12 -4,-5.627; 13 -3.2,-5.627; 14 -2.4,-5.627; 15 -1.6,-5.627; 16 -0.8,-5.627; 17 0,-5.627; 18 0.8,-5.627; 19 1.6,-5.627; 20 2.4,-5.627; 21 3.2,-5.627; 22 4,-5.627; 34 4,5.627; 35 3.2,5.627; 36 2.4,5.627; 37 1.6,5.627; 38 0.8,5.627; 39 0,5.627; 40 -0.8,5.627; 41 -1.6,5.627; 42 -2.4,5.627; 43 -3.2,5.627; 44 -4,5.627
RN4871 = smd 1.5 x 0.7: 1 -4.25,0.95; 2 -4.25,-0.25; 3 -4.25,-1.45; 4 -4.25,-2.65; 5 -4.25,-3.85; 12 4.25,-3.85; 13 4.25,-2.65; 14 4.25,-1.45; 15 4.25,-0.25; 16 4.25,0.95 | smd 0.7 x 1.5: 6 -3,-5.5; 7 -1.8,-5.5; 8 -0.6,-5.5; 9 0.6,-5.5; 10 1.8,-5.5; 11 3,-5.5
MSOP_10 = smd 1.4 x 0.3: 1 -2.2,1; 2 -2.2,0.5; 3 -2.2,0; 4 -2.2,-0.5; 5 -2.2,-1; 6 2.2,-1; 7 2.2,-0.5; 8 2.2,0; 9 2.2,0.5; 10 2.2,1
SO8 = smd 1.5 x 0.8: 1 -3,1.905; 2 -3,0.635; 3 -3,-0.635; 4 -3,-1.905; 5 3,-1.905; 6 3,-0.635; 7 3,0.635; 8 3,1.905
SO8_EP = smd 1.5 x 0.8: 1 -3,1.905; 2 -3,0.635; 3 -3,-0.635; 4 -3,-1.905; 5 3,-1.905; 6 3,-0.635; 7 3,0.635; 8 3,1.905 | smd 2.7 x 3.7: PAD 0,0
SO14 = smd 0.5 x 2: 1 -3.81,-3.05; 2 -2.54,-3.05; 3 -1.27,-3.05; 4 0,-3.05; 5 1.27,-3.05; 6 2.54,-3.05; 7 3.81,-3.05; 8 3.81,3.05; 9 2.54,3.05; 10 1.27,3.052; 11 0,3.05; 12 -1.27,3.05; 13 -2.54,3.05; 14 -3.81,3.05
SOT25 = smd 0.55 x 0.8: 1 0.95,1.2; 2 0,1.2; 3 -0.95,1.2; 4 -0.95,-1.2; 5 0.95,-1.2
EE-SY171 = drill 0.6: A 7.5,1.25; C -7.5,-1.25; K 7.5,-1.25 | drill 0.6 square: E -7.5,1.25
MALE_1WAY_2X5 = drill 0.8 square: 1 -5.08,1.27 | drill 0.8: 2 -2.54,1.27; 3 0,1.27; 4 2.54,1.27; 5 5.08,1.27; 6 -5.08,-1.27; 7 -2.54,-1.27; 8 0,-1.27; 9 2.54,-1.27; 10 5.08,-1.27
MALE_PIN_1X4 = drill 0.8 square: 1 -3.81,0 | drill 0.8: 2 -1.27,0; 3 1.27,0; 4 3.81,0
MICRO_USB_FEMALE = smd 0.4 x 1.35: D+ 0,2.7; D- -0.65,2.7; GND 1.3,2.7; NC 0.65,2.7; VCC -1.3,2.7 | drill 0.85 pad 1.45: NC@2 -2.5,2.7; NC@3 2.5,2.7 | drill 1.1: NC@4 -3.5,0; NC@5 3.5,0
BATTERY_186501X2 = drill 1.2: +1 -35.82,9.55; +2 35.82,-9.58; -1 35.82,9.55; -2 -35.82,-9.58 | hole 3.18: -27.5,0; 27.5,0 | hole 3.45: -27.5,-17.5; 27.5,17.5 | hole 2.38: 27.5,-17.5
MALE_PIN_1X6 = drill 0.8 square: 1 -6.35,0 | drill 0.8: 2 -3.81,0; 3 -1.27,0; 4 1.27,0; 5 3.81,0; 6 6.35,0
MALE_PIN_2X3 = drill 0.8 square: 1 -2.54,1.27 | drill 0.8: 2 0,1.27; 3 2.54,1.27; 4 -2.54,-1.27; 5 0,-1.27; 6 2.54,-1.27
SCREW_1X3 = drill 1.6 square: 1 -5,0 | drill 1.6: 2 0,0; 3 5,0
SMD_OSCILLATOR = smd 5.5 x 1.6: 1 -2.95,0; 2 2.95,0

### Placement (x,y rotation side)
C1  65,141.3 135 top
C2  51.6,126.1 135 top
C3  49.4,125.6 135 top
C4  61.6,45.7 90 top
C5  27.2,19.1 270 top
C6  34.7,53 0 top
C7  113,13 90 top
C8  84.1,113 225 top
C9  83.5,120.5 315 top
C10  76.86,121.57 45 top
C11  74.4,110.5 225 top
C12  56.14,114.82 45 top
C13  61.2,105.54 135 top
C14  67.36,108.8 225 top
C15  69.9,115 45 top
C16  71.5,143.4 90 top
D1  47.8,144.7 135 top
D2  28,52 270 top
D3  79.8,113.2 135 top
D4  59.24,116.18 315 top
L1  68.6,140.4 315 top
L2  76.5,116.5 135 top
L3  65.85,113.25 315 top
Q1  91,53 0 top
Q2  34,46 180 top
Q3  52,49.6 90 top
Q4  68.2,51.9 0 top
Q5  105.6,111.5 315 top
Q6  99.8,117.3 315 top
Q7  94,123.1 315 top
Q8  88.2,128.9 315 top
Q9  82.4,134.7 315 top
Q10  76.6,140.5 315 top
Q11  66.1,157 90 top
R1  48,130.4 315 top
R2  55,147.6 180 top
R3  42,142.8 225 top
R4  55,145.7 180 top
R5  26,66 0 top
R6  18.5,28 0 top
R7  27.2,23.9 90 top
R8  31,66 0 top
R9  91,46 0 top
R10  121.5,18.7 270 top
R11  118.5,21.5 270 top
R12  114.5,21 270 top
R13  20,66 0 top
R14  100.2,69.74 0 top
R15  38.2,145.1 225 top
R16  36.8,146.5 225 top
R17  41.8,146 45 top
R18  35.4,147.9 45 top
R19  55.3,111.1 45 top
R20  71.3,113.6 45 top
R21  72.7,112.2 225 top
R22  57.86,108.94 315 top
R23  60,146.6 90 top
R24  63.8,146.6 90 top
R25  67.6,146.6 90 top
R26  61.9,146.6 270 top
R27  65.7,146.6 270 top
R28  69.5,146.6 270 top
R29  70.2,158 0 top
R30  119.25,168 270 top
R31  99.25,168 270 top
R32  79.25,168 270 top
R33  69.25,168 270 top
R34  49.25,168 270 top
R35  29.25,168 270 top
R36  107.65,163 0 top
R37  97.65,163 0 top
R38  87.65,163 0 top
R39  77.65,163 0 top
R40  67.65,163 0 top
R41  57.65,163 0 top
R42  37.65,163 0 top
R43  47.65,163 0 top
R44  17.65,163 0 top
R45  27.65,163 0 top
S1  40.55,130.15 315 top
S2  81,48 0 top
U1  57,136 45 top
U2  39.5,114.2 135 top
U3  25,28 0 top
U4  116,17 180 top
U5  80.9,117.7 315 top
U6  62.1,110.63 315 top
U7  66,127 315 top
U8  60.6,123.5 315 top
U9  63,121.1 315 top
U10  65.4,118.7 315 top
U11  118,168 90 bottom
U12  108,168 90 bottom
U13  98,168 90 bottom
U14  88,168 90 bottom
U15  78,168 90 bottom
U16  68,168 90 bottom
U17  58,168 90 bottom
U18  48,168 90 bottom
U19  38,168 90 bottom
U20  28,168 90 bottom
U21  18,168 90 bottom
X1  30.7,128.6 270 top
X2  41.8,138.6 0 top
X3  22,71 0 top
X4  69,20 0 top
X5  17.2,139.6 180 top
X6  16.9,117.8 180 top
X7  26.2,141.7 270 top
X8  117.7,139.6 180 top
X9  118.1,117.8 180 top
X10  109,137 90 top
X11  68,153.7 0 top
X12  96,138 135 top
XTAL1  51.25,120.27 0 top

### Tracks (layer width: path | path; a pad name or v marks a point on that pad's centre or on a via)
3V3  (via drill 0.4)  (4 unrouted)
  Top 0.3: X11.1 64.19,156.81 64.4,157 Q11.3 | R1.2 U1.5 53.87,134 59,134 | U1.17 59,134 | 59,134 61.56,134 63.39,135.83 66.29,135.83 L1.2 | U1.38 59,135.13 59,134 | 69.87,139.27 L1.2 | L1.2 71.5,141.04 C16.1 | C10.1 77.43,118.74 | 77.43,118.74 U5.4 | L2.2 76.47,118.74 77.43,118.74 | X7.4 26.47,142.7 27.89,142.7 31.99,138.6 X2.1 | X10.4 114.29,130.44 X9.5 | X6.5 14.89,116 33.4,116 35.91,118.51 36.53,118.51 36.81,118.23 U2.14
  Bottom 0.3: X1.6 30.17,133.68 31.17,134.68 37.71,134.68 | R1.2 45.71,132.69 40,132.69 | 40,132.69 39.7,132.69 37.71,134.68 | U2.14 37.52,130.21 40,132.69 | X2.1 37.99,134.97 37.71,134.68
  other vias: 49.13,129.27 37.52,118.23
3V3_SENSOR_LEDS  (via drill 0.4)
  Top 0.3: Q11.2 R29.1 v70.2,158 | v70.2,164.7 69.25,165.65 R33.2 | R33.2 R32.2 R31.2 R30.2 | R33.2 R34.2 R35.2
  Bottom 0.3: v70.2,158 v70.2,164.7
5V_USB  (6 unrouted)
  Top 0.3: Q3.1 C4.2 Q4.1 | Q2.1 C6.2 36.3,53.88 arc45 36.21,54.09 35.7,54.6 29.47,54.6 arc45 29.26,54.51 D2.1
6V  (via drill 0.4)
  Top 0.3: R20.2 C15.2 70.99,116.13 70.11,115.24 68.45,115.24 67.39,114.19 67.39,112.53 L3.2
  Top 1: R3.2 33.33,141.67 28,147 v21,147 14,147 8,141 8,112 17.32,102.68 62.45,102.68 63.76,104 v67,104 115,104 127,116 127,136 123.4,139.6 X8.1
  Bottom 1: X5.1 v21,147 | L3.2 66.98,104.02 v67,104
  other vias: 66.98,112.12
AVCC  (1 unrouted)
  Top 0.3: L1.1 67.47,141.51 C1.1 | U1.27 62.73,140.6 63.7,140.6 64.7,139.6 65.6,139.6
BATT1+  (1 unrouted)
  Top 0.3: U4.10 111,16 | C7.2 113,16
  Top 1: Q4.2 74.8,43 108,43 111,40 111,16 105.42,10.42 X4.+2
BATT2+
  Top 0.3: U3.10 27.66,29.46 arc-45 27.87,29.55 33,29.55 | 33,29.55 X4.+1 | C5.2 32.91,23.21 arc45 33,23.42 33,29.55
  Top 1: Q2.3 33.27,42.97 arc45 33.18,42.76 X4.+1
BATT2-  (1 unrouted)
  Top 0.3: R7.1 C5.1 25.82,20.7 arc45 25.61,20.61 25,20 25,17 26,16 56.08,16 arc45 56.29,16.09 69.75,29.55
  Top 1: Q4.3 54.3,54.2 Q3.3 57.15,42.15 | 57.15,42.15 69.75,29.55 X4.-1 | C4.1 59.65,42.15 57.15,42.15
BATT_CHARGING  (3 unrouted)
BATTERY1_CHARGING1
  Top 0.3: U4.3 121.68,17 arc45 121.89,17.09 R10.2
BATTERY2_CHARGING1
  Top 0.3: U3.3 R6.2
BEMF_A
  Top 0.3: U1.32 59.91,143.44 arc45 60,143.65 R23.1 R26.2
BEMF_B
  Top 0.3: R27.2 R24.1 63.8,144.7 62.4,143.3 60.91,143.3 U1.31
BEMF_C
  Top 0.3: R28.2 R25.1 67.6,144.5 67,143.9 63.71,143.9 62.61,142.8 61.54,142.8 U1.30
BT_EN  (via drill 0.4)
  Top 0.3: U2.6 46.54,117 v55,117 | v50.09,138.38 U1.43
  Bottom 0.3: v55,117 55,133.47 v50.09,138.38
BT_RX
  Top 0.3: U2.7 46.47,118.62 57.3,118.62 57.8,119.12 57.8,124.61 54.4,128.01 54.4,128.8 55.28,129.68 U1.10
BT_SETUP  (via drill 0.4)
  Top 0.3: U2.4 45.09,113.07 45.37,112.79 45.66,112.79 48.87,116 v54,116 | v50.15,137.11 U1.44
  Bottom 0.3: v54,116 54,133.26 v50.15,137.11
BT_TX
  Top 0.3: U2.8 45.27,119.12 57.09,119.12 57.3,119.33 57.3,124.41 53.7,128.01 53.7,129.3 U1.9
C_MEAS_H
  Top 0.3: U1.37 51.9,143.37 51.9,144.07 46.98,148.98 45.13,147.13 R17.2 42.06,148 41.1,148 R15.1
C_MEAS_L
  Top 0.3: U1.36 52.4,144 52.4,144.27 46.97,149.71 40.01,149.71 R16.1 R18.2
GND  (62 unrouted)
  pour Top: 8,181 128,181 128,151 8,151
LED_BLUE
  Top 0.3: U1.40 50.82,141.05 50.82,143.94 D1.3
LED_GREEN
  Top 0.3: U1.41 49.74,141 49,141 48.47,141.53 D1.1
LED_RED
  Top 0.3: U1.42 49.11,140.5 48.53,140.5 47.31,141.73 47.31,142.02 48.22,142.93 49.57,142.93 D1.2
LINE_SENSOR_EN  (via drill 0.4)  (1 unrouted)
  Top 0.3: X11.3 69.27,154.83 68.1,156 Q11.1 | U1.26 61.83,138.85 61.42,138.44 61.13,138.44 57.96,141.6 v56.4,141.6
  Bottom 0.3: v56.4,141.6 49.68,141.6 47,138.93 47,138 46.4,137.4 44.27,137.4 X2.3
LINE_SENSOR_OUT  (via drill 0.4)  (1 unrouted)
  Top 0.3: X11.4 R29.2 71.8,159.4 | 71.8,159.4 72.9,160.5 U15.C 78.25,159 85.25,159 U14.C 88.25,159 95.25,159 U13.C 98.25,159 105,159 106.5,160.5 U12.C 108.25,159 115.25,159 U11.C | 71.8,159.4 67.85,159.4 U16.C 65.25,159 58.25,159 U17.C 55.25,159 48.25,159 U18.C 45.25,159 38.25,159 U19.C 35.25,159 28.25,159 U20.C 25.25,159 18.25,159 U21.C
  Bottom 0.3: X2.4 51.01,144 v57,144
M1_LEFT
  Top 1: X7.6 22.87,139.16 21.95,138.25 14.74,138.25 X5.4
M1_RIGHT
  Top 1: X8.4 110.33,139.6 X10.6
M2_LEFT
  Top 1: X7.5 18.03,141.7 X5.3
M2_RIGHT
  Top 1: X10.5 113.83,137 X8.3
MISO
  Top 0.3: X1.5 31.97,124.64 30.47,126.14 30.47,131.06 31.55,132.14 35.44,132.14 39.29,136 45.71,136 48.21,133.5 49.98,133.5 U1.2
MLEFT_DIR  (via drill 0.4)
  Top 0.3: U1.11 55.85,127.63 v58.24,125.24
  Bottom 0.3: X6.2 21.45,117.8 22.45,116.8 24.05,116.8 26.05,116.8 52.13,116.8 53.69,115.25 54.31,115.25 55.75,116.69 55.75,122.75 v58.24,125.24
MLEFT_OUTA  (via drill 0.4)
  Top 0.3: v46,140.5 46.41,140.5 47.7,139.2 48.1,139.2 v48.7,138.6 | v61.84,135.84 62.49,135.84 U1.23
  Bottom 0.3: X7.3 35.36,139.16 36.6,140.4 45.9,140.4 v46,140.5 | v61.84,135.84 55.23,135.84 51.93,139.13 49.78,139.13 49.24,138.6 v48.7,138.6
MLEFT_OUTB  (via drill 0.4)
  Top 0.3: v46.96,141.01 48.27,139.7 v48.84,139.7 | v63.85,134.89 U1.22
  Bottom 0.3: X7.2 46.27,141.7 v46.96,141.01 | v63.85,134.89 61.88,136.86 61.7,136.86 58.86,139.7 v48.84,139.7
MLEFT_PWM  (via drill 0.4)
  Top 0.3: U1.13 56,132.47 v56,133 | v53,137 51.44,137 50.61,136.17 50.02,136.17 49.2,137 29,137 23.25,131.25 X6.1
  Bottom 0.3: v56,133 56,134 v53,137
MOSI
  Top 0.3: X1.1 34.79,136.5 45.91,136.5 48.41,134 49.34,134 U1.1
MOTOR_EN  (via drill 0.4)  (1 unrouted)
  Top 0.3: U1.21 63.39,134.28 63.8,133.87 73.13,133.87 v74,133 | v97.7,142.3 v113,127 | v64,105.1 103.37,105.1 103.55,104.93 106.5,104.93 X9.3
  Bottom 0.3: v74,133 88.4,133 v97.7,142.3 | v113,127 119.37,120.63 X9.3 | v64,105.1 30.87,105.1 X6.3
MRIGHT_DIR  (via drill 0.4)
  Top 0.3: U1.12 58.15,126.85 v59,126
  Bottom 0.3: v59,126 59,122.61 58.23,121.84 58.23,119.67 58.67,119.23 63,115 120,115 121.91,116.91 X9.2
MRIGHT_OUTA  (via drill 0.4)
  Top 0.3: X10.3 103.24,144.03 v84.03,144.03 | v70,143.8 69,142.8 69,141 66.13,138.13 63.93,138.13 63.52,137.72 U1.24
  Bottom 0.3: v84.03,144.03 70.24,144.03 v70,143.8
MRIGHT_OUTB  (via drill 0.4)
  Top 0.3: v85.03,143.03 91.77,143.03 91.82,143.09 101.64,143.09 X10.2 | v62.01,137.62 U1.25
  Bottom 0.3: v85.03,143.03 67.43,143.03 v62.01,137.62
MRIGHT_PWM  (via drill 0.4)
  Top 0.3: U1.14 v58.62,130.99 | v58.62,130.99 | v63,130 64.32,128.68 v65.66,128.68
  Bottom 0.3: v58.62,130.99 62.01,130.99 v63,130 | X9.1 113.57,128.68 107.52,128.68 99.68,136.51 99.39,136.51 91.56,128.68 v65.66,128.68
MTURBO_A  (via drill 0.4)
  Top 0.3: R23.2 60.7,148.9 60.7,148.94 61.91,150.15 76.85,150.15 101.43,125.57 Q6.3
  Top 2: Q6.3 Q5.3
  Bottom 2: X12.1 99.54,120.82 Q6.3
  other vias: 101.43,118.93
MTURBO_B  (via drill 0.4)  (1 unrouted)
  Top 0.3: R24.2 64.5,148.9 64.5,148.94 65.2,149.65 76.35,149.65 90,136 90,130.7 Q8.3
  Top 2: Q8.3 Q7.3 | 95.03,124.23
  Bottom 2: X12.2 89.83,131.83 Q8.3
  other vias: 89.83,130.53
MTURBO_C  (via drill 0.4)
  Top 0.3: R25.2 68.3,148.9 68.3,148.94 68.5,149.15 71.2,149.15 Q10.3
  Top 2: Q10.3 Q9.3
  Bottom 2: X12.3 87.25,136.33 Q9.3
  other vias: 84.03,136.33
MTURBO_DIR_A
  Top 0.3: U7.1 61.15,130.72 U1.16
MTURBO_DIR_B  (via drill 0.4)
  Top 0.3: v62.78,132.49 | v62.78,132.49 U1.19
  Bottom 0.3: U7.4 63.84,131.42 v62.78,132.49
  other vias: 63.84,124.84
MTURBO_DIR_C
  Top 0.3: U7.9 69.95,128.31 70.29,128.65 70.29,128.94 68.84,130.39 68.44,130.39 66.87,128.82 66.58,128.82 64.23,131.18 64.23,132.16 U1.20
MTURBO_PWM
  Top 0.3: U1.15 60.5,130.24 60.5,127.74 59.91,127.15 59.91,126.86 60.47,126.3 60.76,126.3 61.1,126.64 U7.2 63.33,127.92 66,127.92 | U7.10 68.72,127.92 66,127.92 | U7.5 66,125.2 66,127.92
N$1
  Top 0.3: U1.7 53.55,131.45 52.7,130.6 52.14,130.6 C3.2 46.84,125.3 46.8,125.3 46.8,124.2 48.3,122.7 XTAL1.1
N$2
  Top 0.3: C2.2 52.12,128.88 | 52.12,128.88 54.13,130.89 U1.8 | XTAL1.2 54.2,126.8 52.12,128.88
N$3
  Top 0.3: U5.1 80.59,121.63 C9.1
N$4
  Top 0.3: U12.E R36.2
N$5  (via drill 0.4)
  Top 0.3: U8.2 62.84,125.74 U7.3 | Q5.1 96.63,109.37 80,126 78.76,126 68.59,115.83 64.66,115.83 60.51,119.98 v58.98,119.98
  Bottom 0.3: v58.98,119.98 58.98,121.88 U8.2
  other vias: 61.45,124.35
N$6
  Top 0.3: U8.4 59.57,122.83 59.57,121.63 64.87,116.33 68.38,116.33 79.06,127 80,127 92,115 94.15,115 Q6.1
N$7
  Top 0.3: U13.E R37.2
N$8
  Top 0.3: R30.1 U11.A
N$9
  Top 0.3: U11.K U12.A
N$10
  Top 0.3: R32.1 U15.A
N$11
  Top 0.3: R31.1 U13.A
N$12
  Top 0.3: U13.K U14.A
N$13
  Top 0.3: U17.A 60.58,176.83 75.42,176.83 U15.K
N$14
  Top 0.3: R34.1 U18.A
N$15
  Top 0.3: U18.K U19.A
N$16
  Top 0.3: U20.A R35.1
N$17
  Top 0.3: U20.K U21.A
N$18
  Top 0.3: R33.1 U16.A
N$19  (via drill 0.4)  (1 unrouted)
  Top 0.3: U9.2 64.95,123.05 U7.6
  Bottom 0.3: v88.52,120.97 87.03,120.97 83,125 81.14,125 80.32,124.17 66.77,124.17 U7.6
  other vias: 65.64,123.05
N$21
  Top 0.3: U14.E R38.2
N$23
  Top 0.3: U17.E R41.2
N$24
  Top 0.3: C1.2 62.84,141.4 62.4,141.4 U1.28
N$25
  Top 0.3: U15.E R39.2
N$26
  Top 0.3: U18.E R43.2
N$27
  Top 0.3: U19.E R42.2
N$28
  Top 0.3: U20.E R45.2
N$29
  Top 0.3: U21.E R44.2
N$30
  Top 0.3: U16.E R40.2
N$37
  Top 0.3: D1.PAD 45.54,144.7 D1.6 44.63,145.37 R3.1 | D1.5 D1.PAD | D1.4 47.8,146.96 D1.PAD
N$38  (1 unrouted)
N$39  (via drill 0.4)
  Bottom 0.3: U10.4 63.88,123.81 64.6,124.53 64.6,131.85 64.7,131.85 Q10.1
  other vias: 63.88,118.52 71.72,138.87
N$40
  Top 0.3: U10.2 70.85,124.15 U7.8 70.85,126.5 | 70.85,126.5 | Q9.1 74.45,130 73,130 72,129 72,127.65 70.85,126.5
N$41
  Top 0.3: R19.2 57.8,112.23 U6.4
N$42
  Top 0.3: C14.2 64.94,108.96 U6.7
N$43
  Top 0.3: U6.5 62.87,104.95 C13.1
N$44
  Top 0.3: R22.2 60.07,106.73 C13.2
N$45
  Top 0.3: U6.2 59.69,113.2 59.43,113.47 57.53,113.47 57,114 55.32,114 C12.1
N$46
  Top 0.3: L3.1 61.61,114.38 U6.1 D4.2 57.93,115.3 C12.2
N$48
  Top 0.3: R20.1 R21.2 71.33,111.07 66.55,106.29 66.26,106.29 64.49,108.06 U6.6
RESET  (1 unrouted)
  Top 0.3: U1.4 51.14,132.4 47.74,132.4 R1.1 46.53,131.53 S1.2 44.44,121.69 U2.10 | X1.3 34.31,126.26 S1.4
SCK
  Top 0.3: X1.4 31.97,127.18 30.97,128.18 30.97,129.02 31.75,129.8 33.8,129.8 39.39,135.38 45.62,135.38 48,133 50.61,133 U1.3
THERM2
  Top 0.3: U4.9 112.62,16.5 arc-45 112.41,16.59 112,17 112,19 112.91,19.91 arc-45 113.12,20 R12.2
THERM3  (1 unrouted)
USB_CONNECTED
  Top 0.3: U1.35 53.49,144.04 arc-45 53.4,144.25 R4.2 R2.2
V_LIMIT2
  Top 0.3: U4.6 113.8,18.68 arc-45 113.89,18.89 114,19 118,19 118.41,19.41 arc45 118.5,19.62 R11.2
V_LIMIT3
  Top 0.3: R7.2 U3.6
VBATT1  (1 unrouted)
  Top 0.3: R9.2 93.21,46.61 arc45 93.3,46.82 Q1.2 | D2.2 31.43,50.75 arc-45 31.64,50.66 Q2.2
VBATT_MEASURED  (6 unrouted)
  Top 1: U8.5 60.84,122.4 61.6,122.4 62.89,121.11 62.89,119.65 63.14,119.9 64.2,119.9 65.22,118.88 U10.5 68.03,117.18 78,127.15 78,127.9 79.92,129.82 Q9.2 | U5.7 85.23,114.27 | C8.1 90.18,109.18 | 90.18,109.18 92.74,106.62 Q5.2 | C11.1 77.98,109.18 90.18,109.18 | R16.2 35.06,145.37 34.73,145.04 33.35,145.04 28.99,149.4 13.01,149.4 9.8,146.2
  Top 2: Q9.2 84.18,129.82 92.37,121.63 Q7.2 95.78,118.22 104,110 103.97,109.97 Q5.2
VBATT_ON  (2 unrouted)
  Top 1: 10.65,145.35 13.5,148.2 28.5,148.2 33.05,143.64 36.14,143.64 36.46,143.97 R15.2
VG1
  Top 0.3: R9.1 88.79,46.61 arc-45 88.7,46.82 88.7,48 | 88.7,48 Q1.1 | S2.3 88.7,48
VSW
  Top 0.3: C9.2 85.1,118.9 85.1,117.7 84.37,116.97 U5.8 82.89,118.4 80.66,118.4 L2.1 D3.2
VUSB  (1 unrouted)